# EAGLE schematic scoutfly_nxp (EAGLE 5.06)
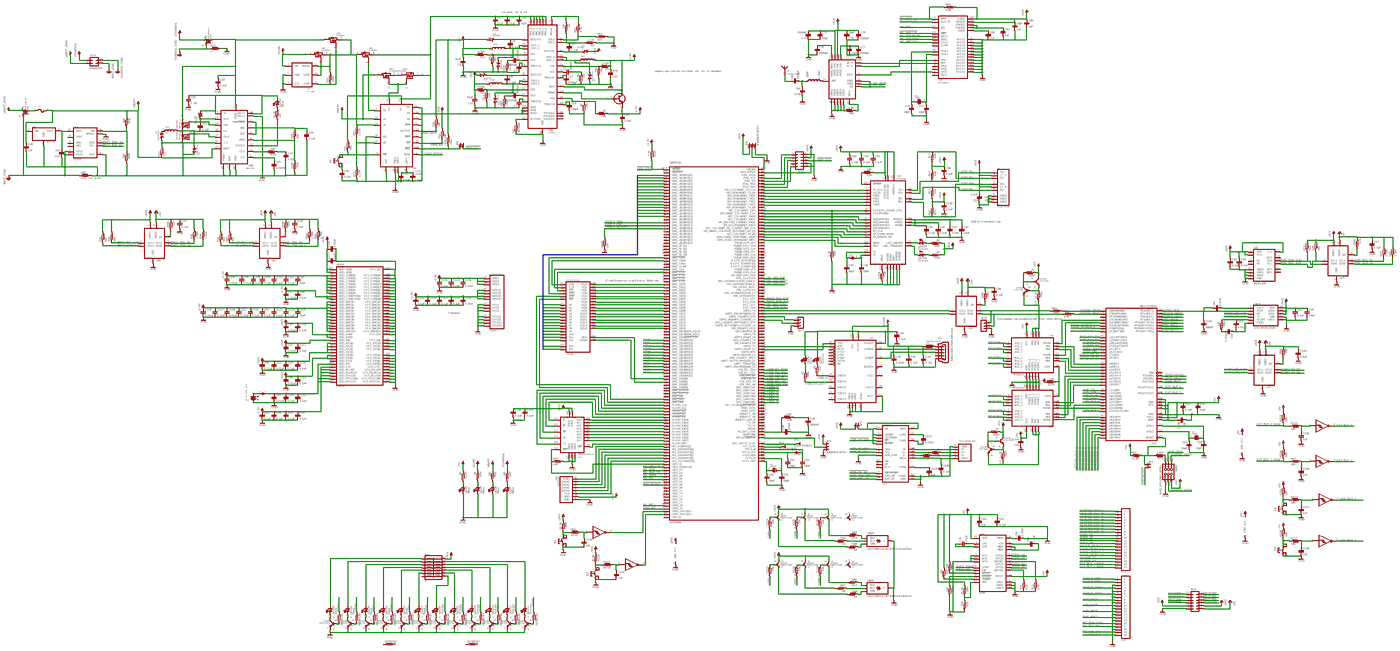
[diagram p0: schematic, sheet 1, overview]
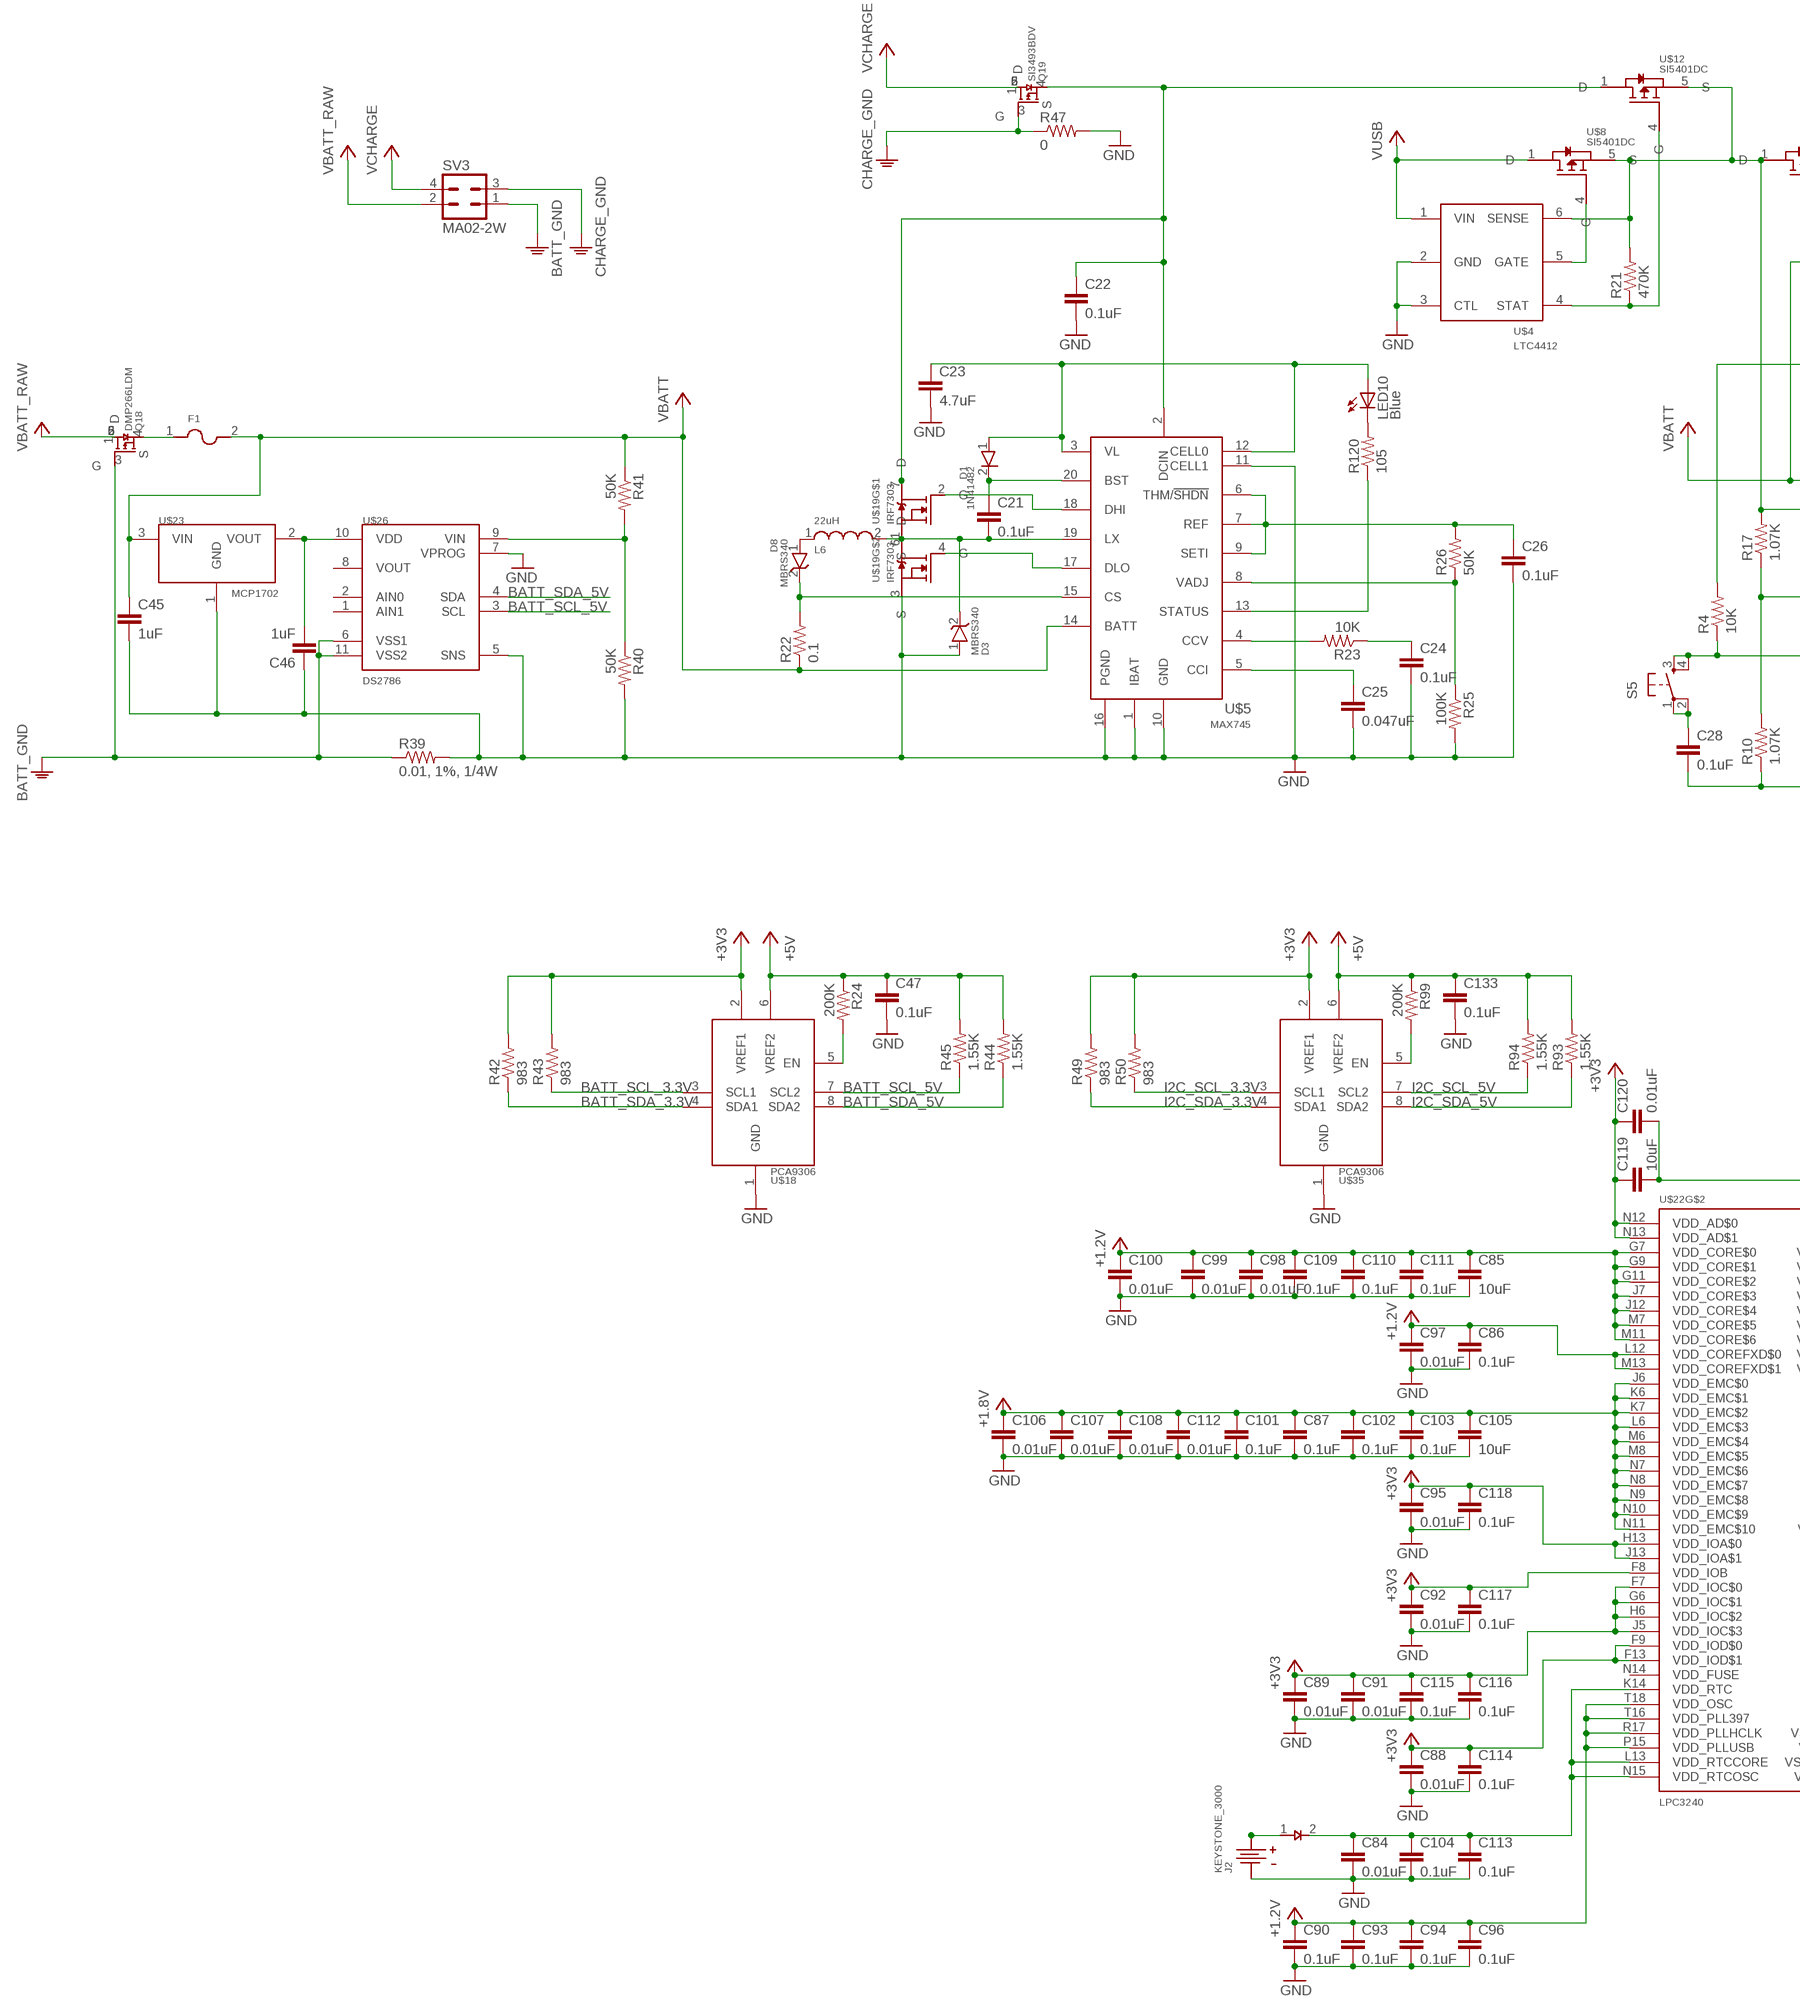
[diagram p1: schematic, sheet 1, part 1 of 7]
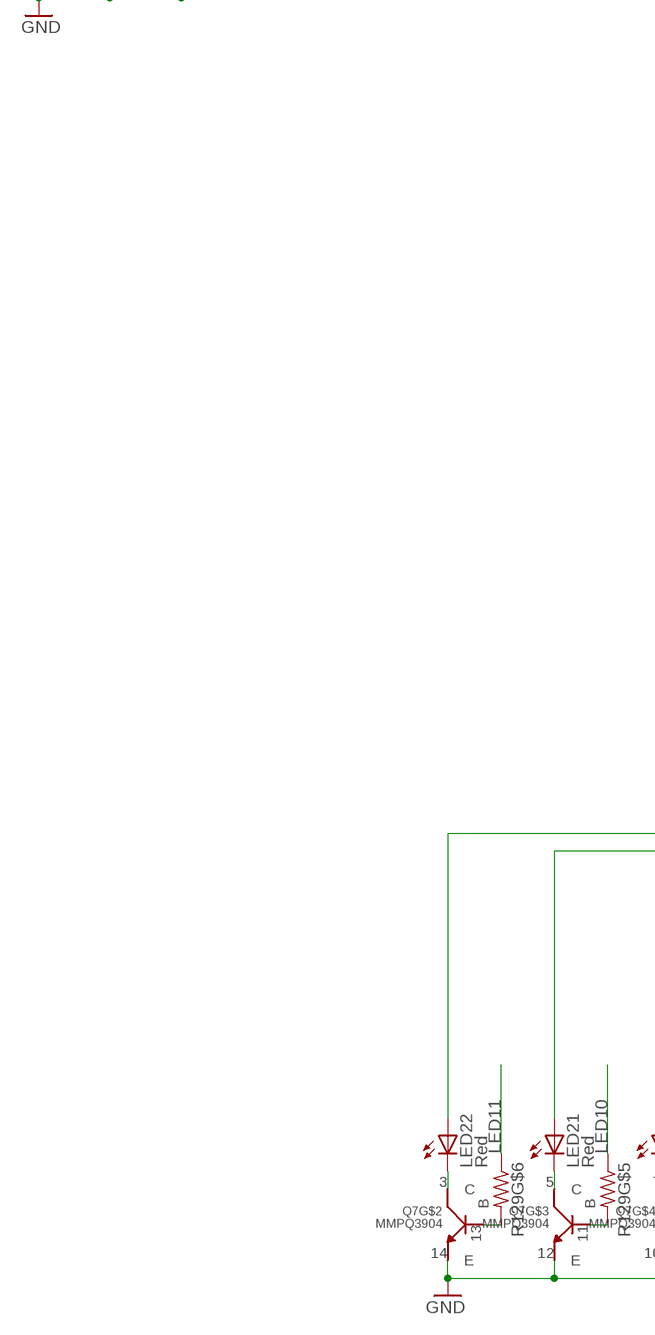
[diagram p2: schematic, sheet 1, part 2 of 7]
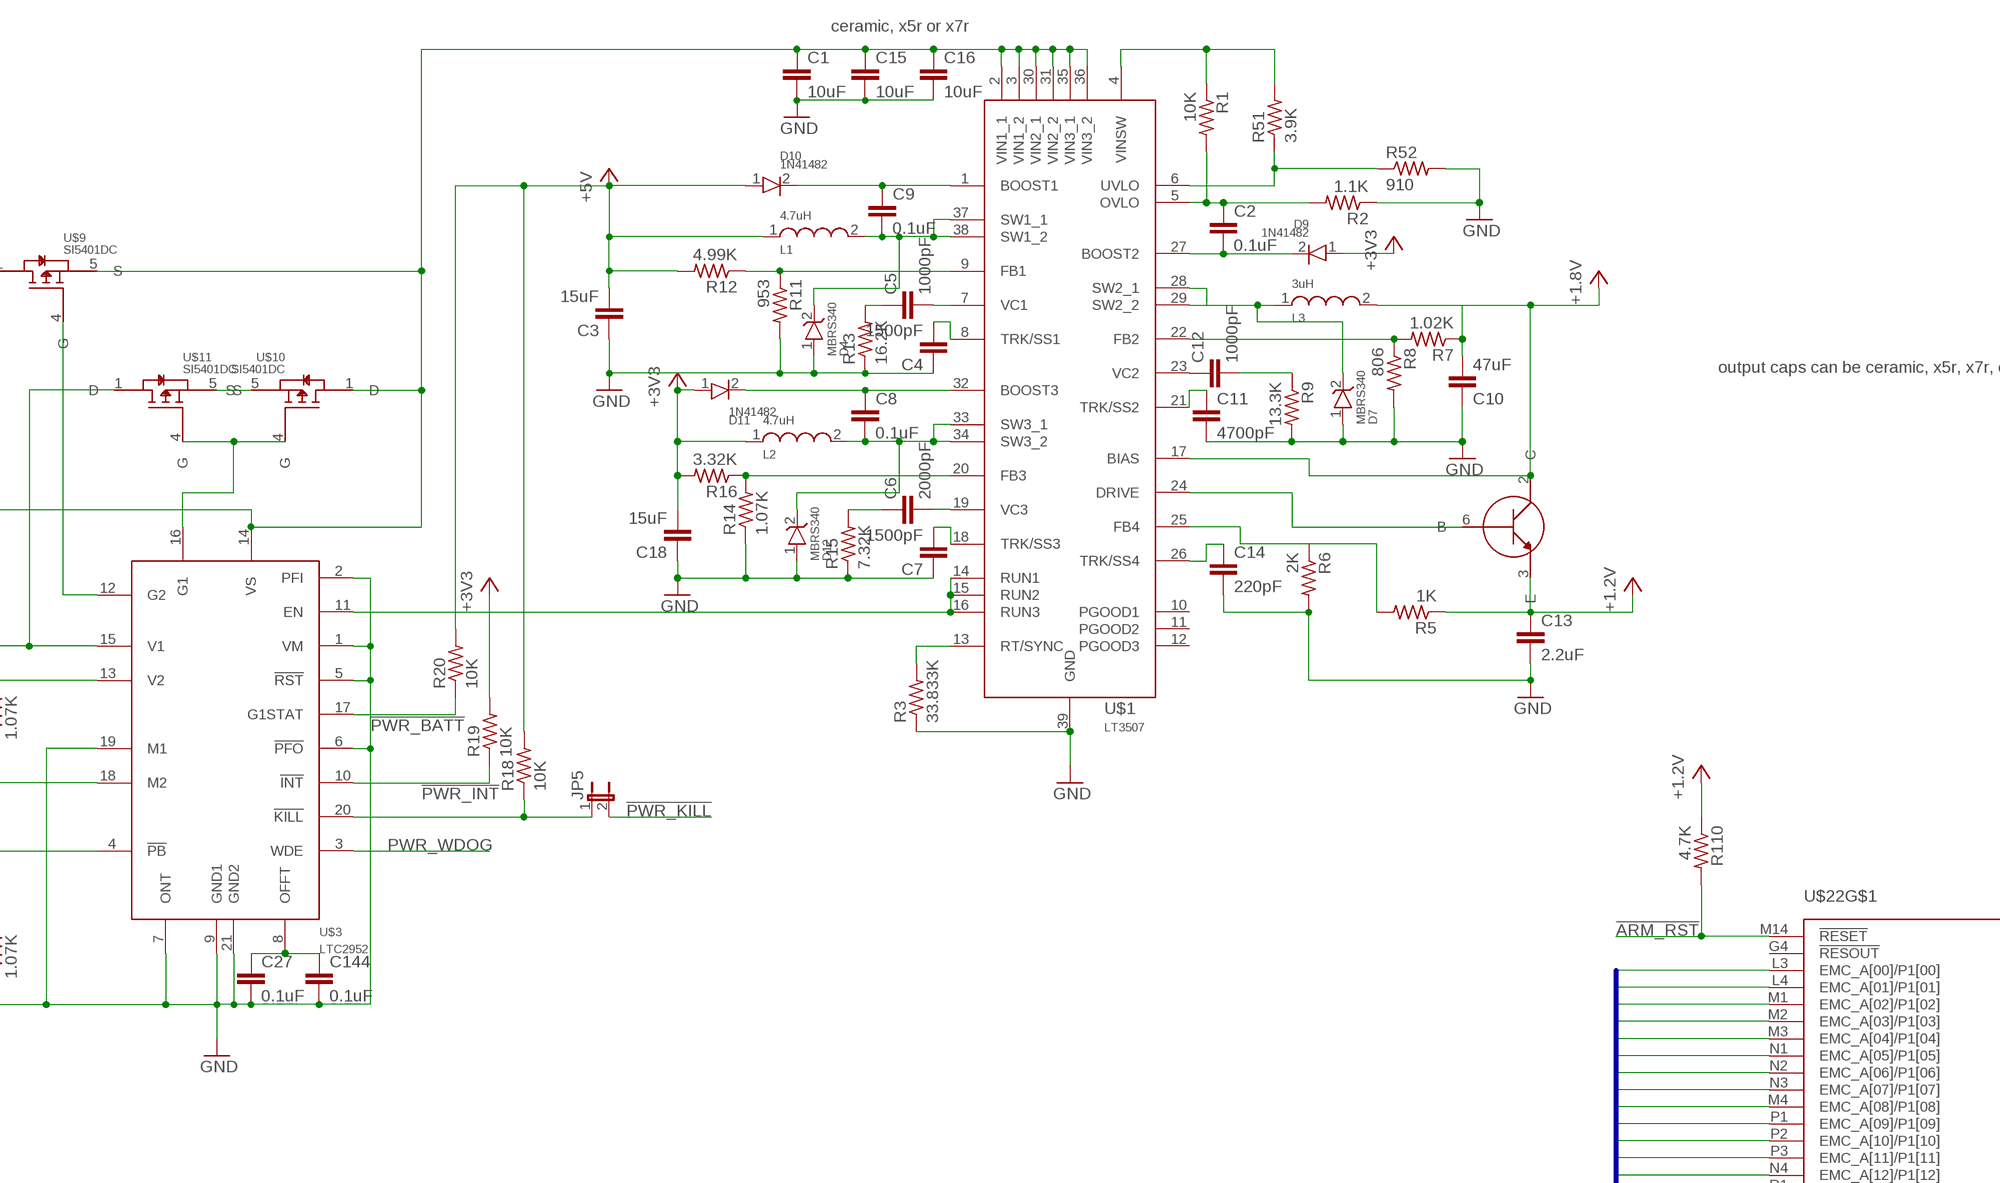
[diagram p3: schematic, sheet 1, part 3 of 7]
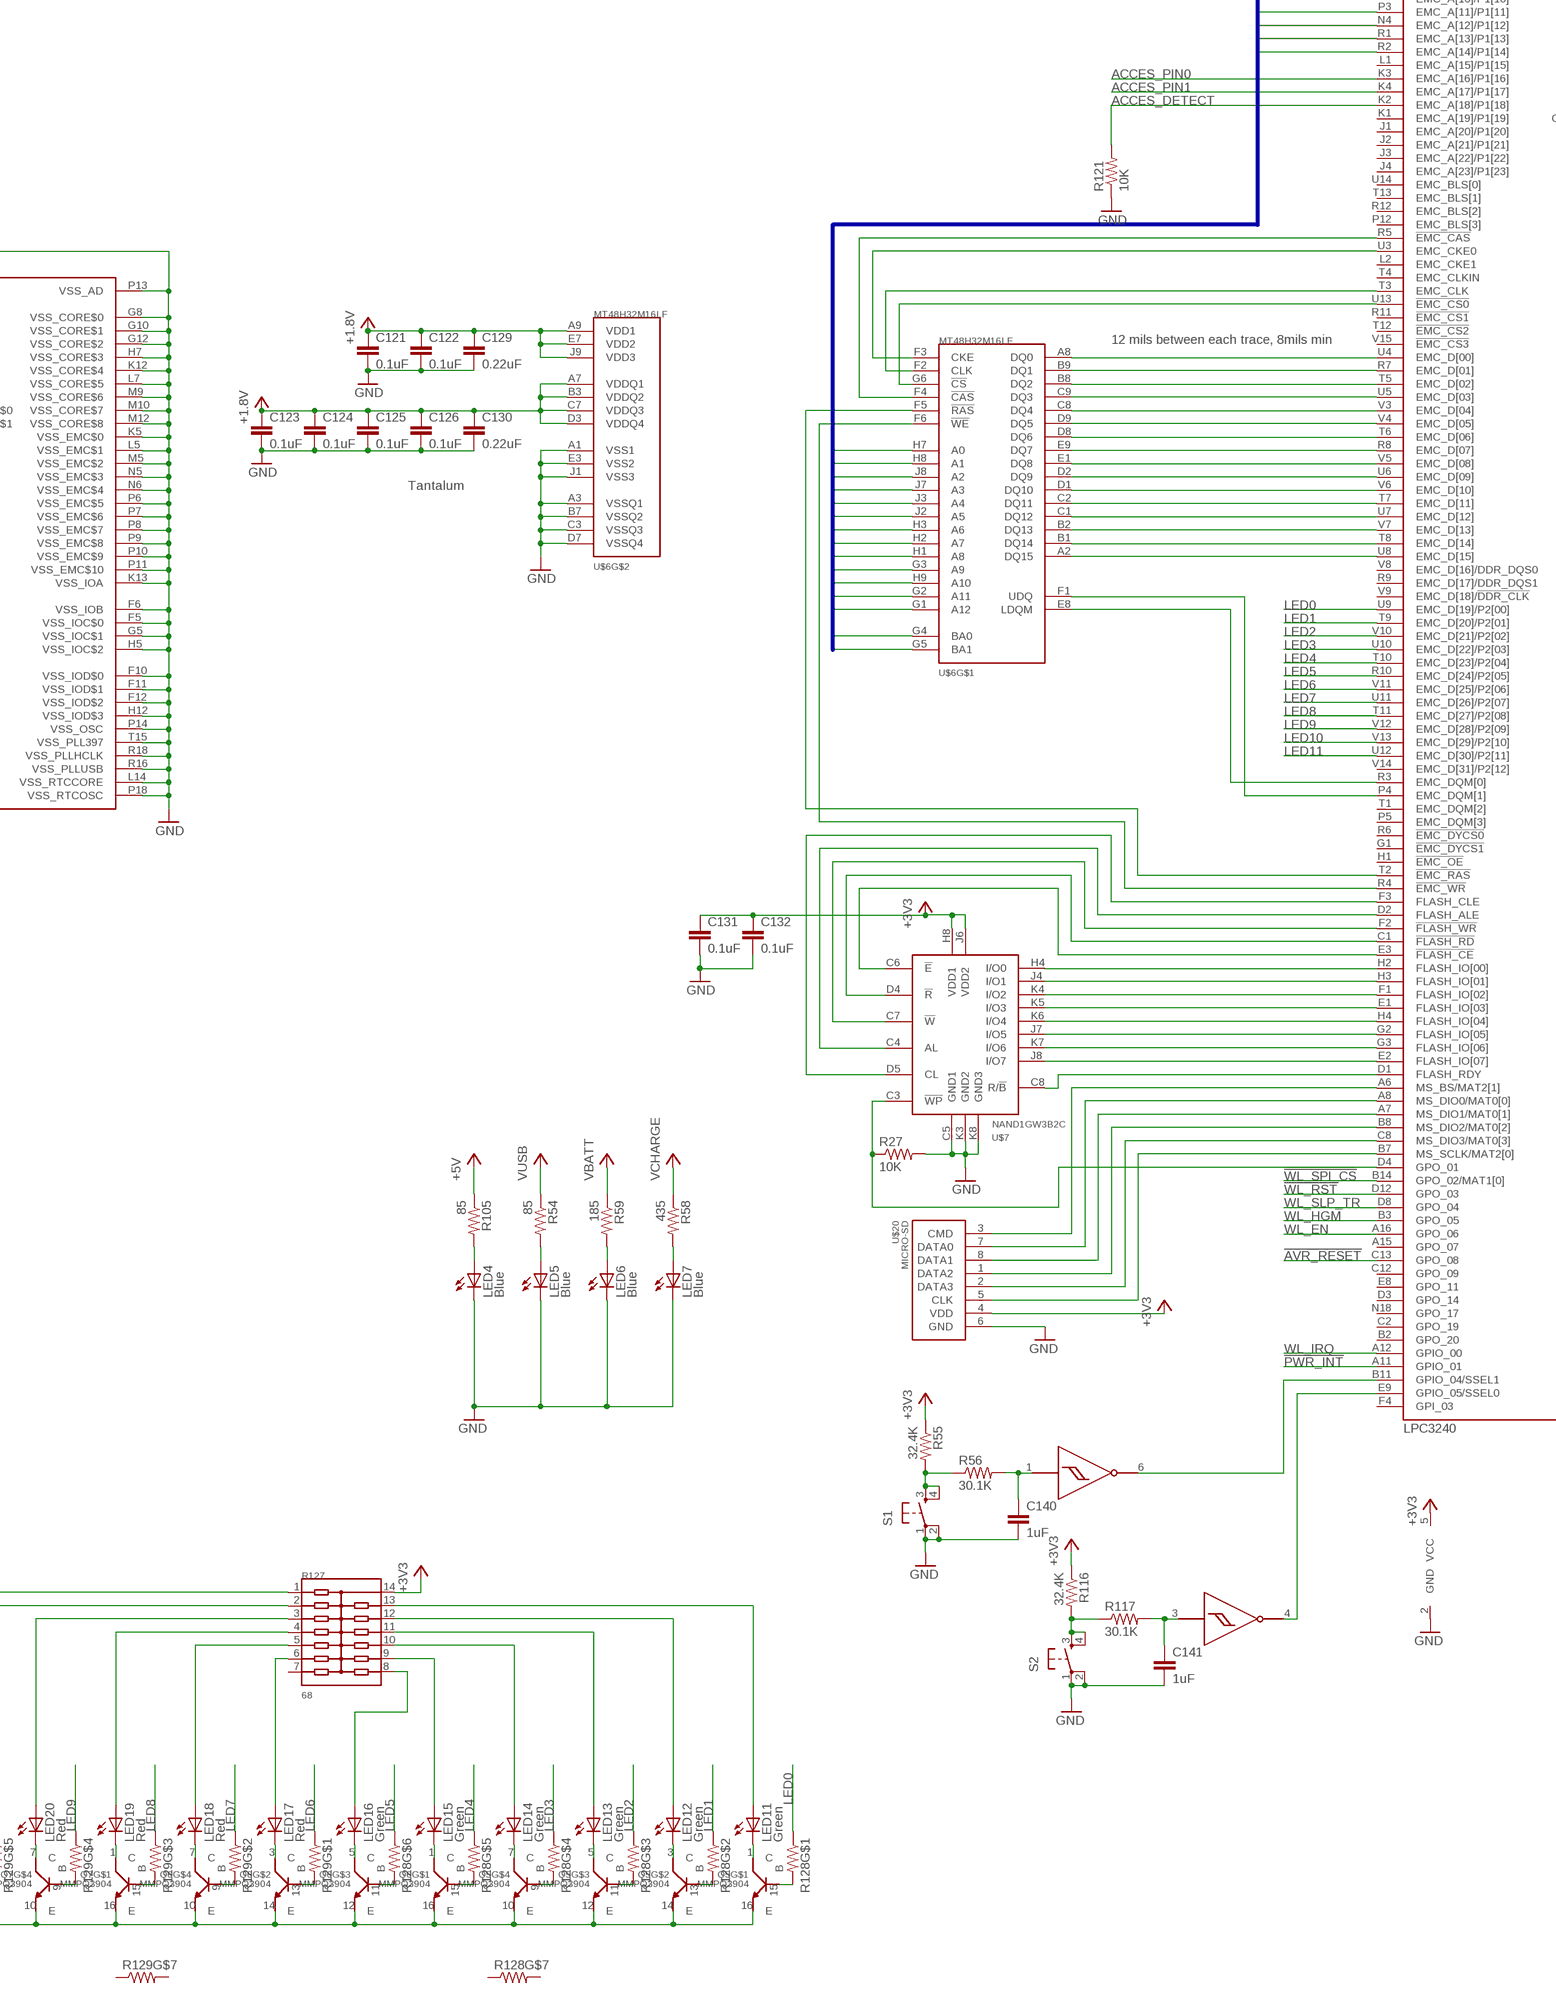
[diagram p4: schematic, sheet 1, part 4 of 7]
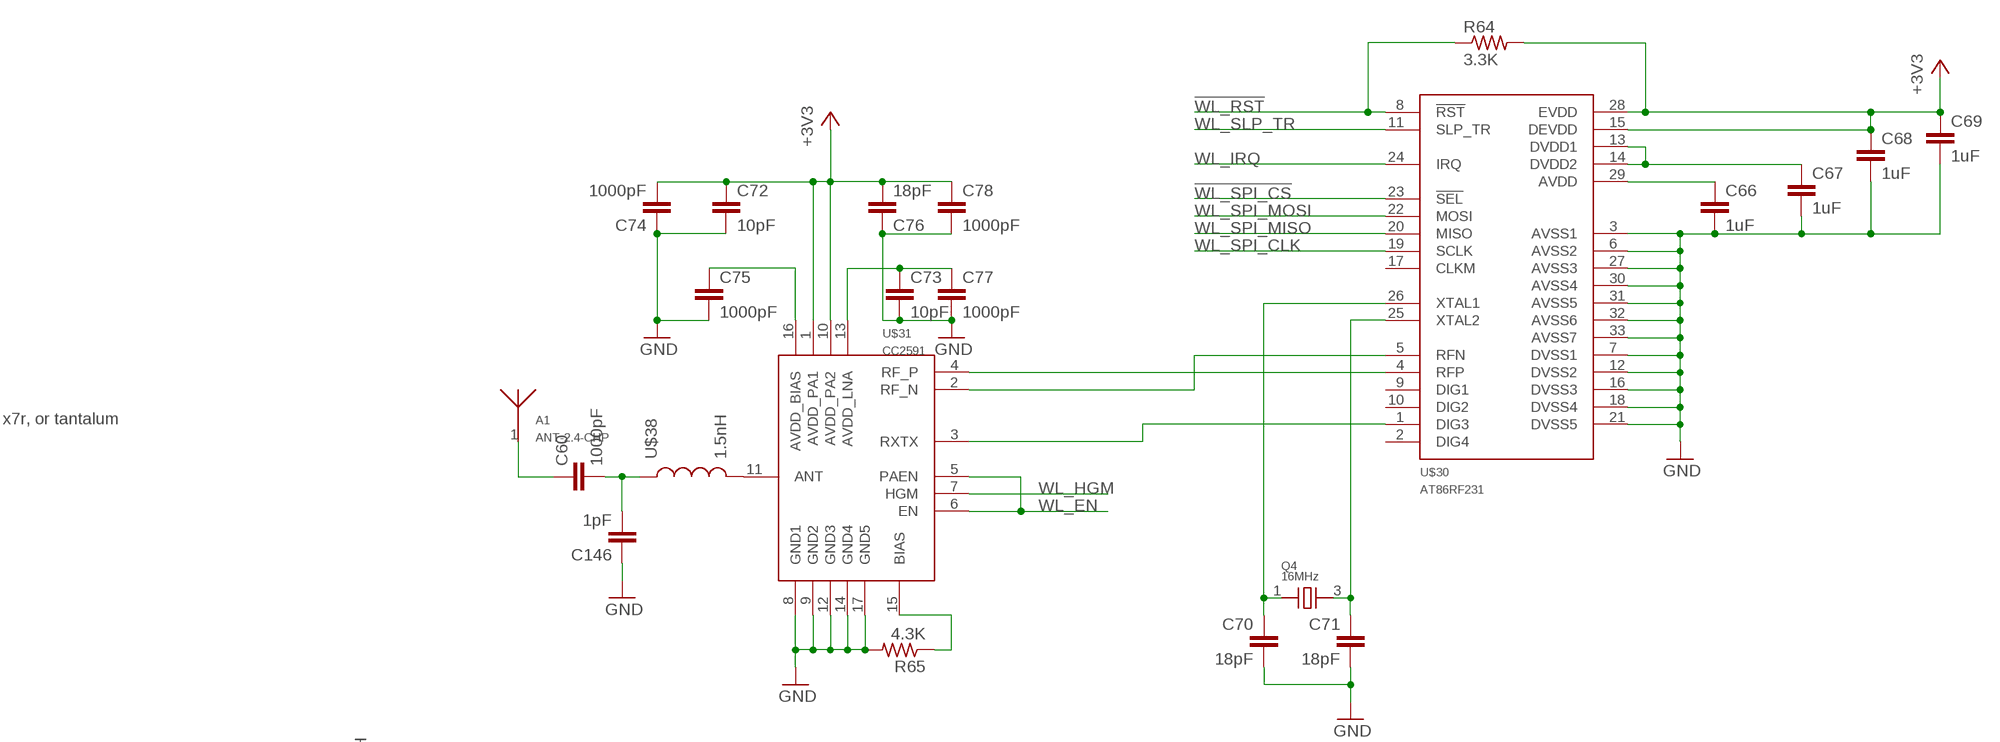
[diagram p5: schematic, sheet 1, part 5 of 7]
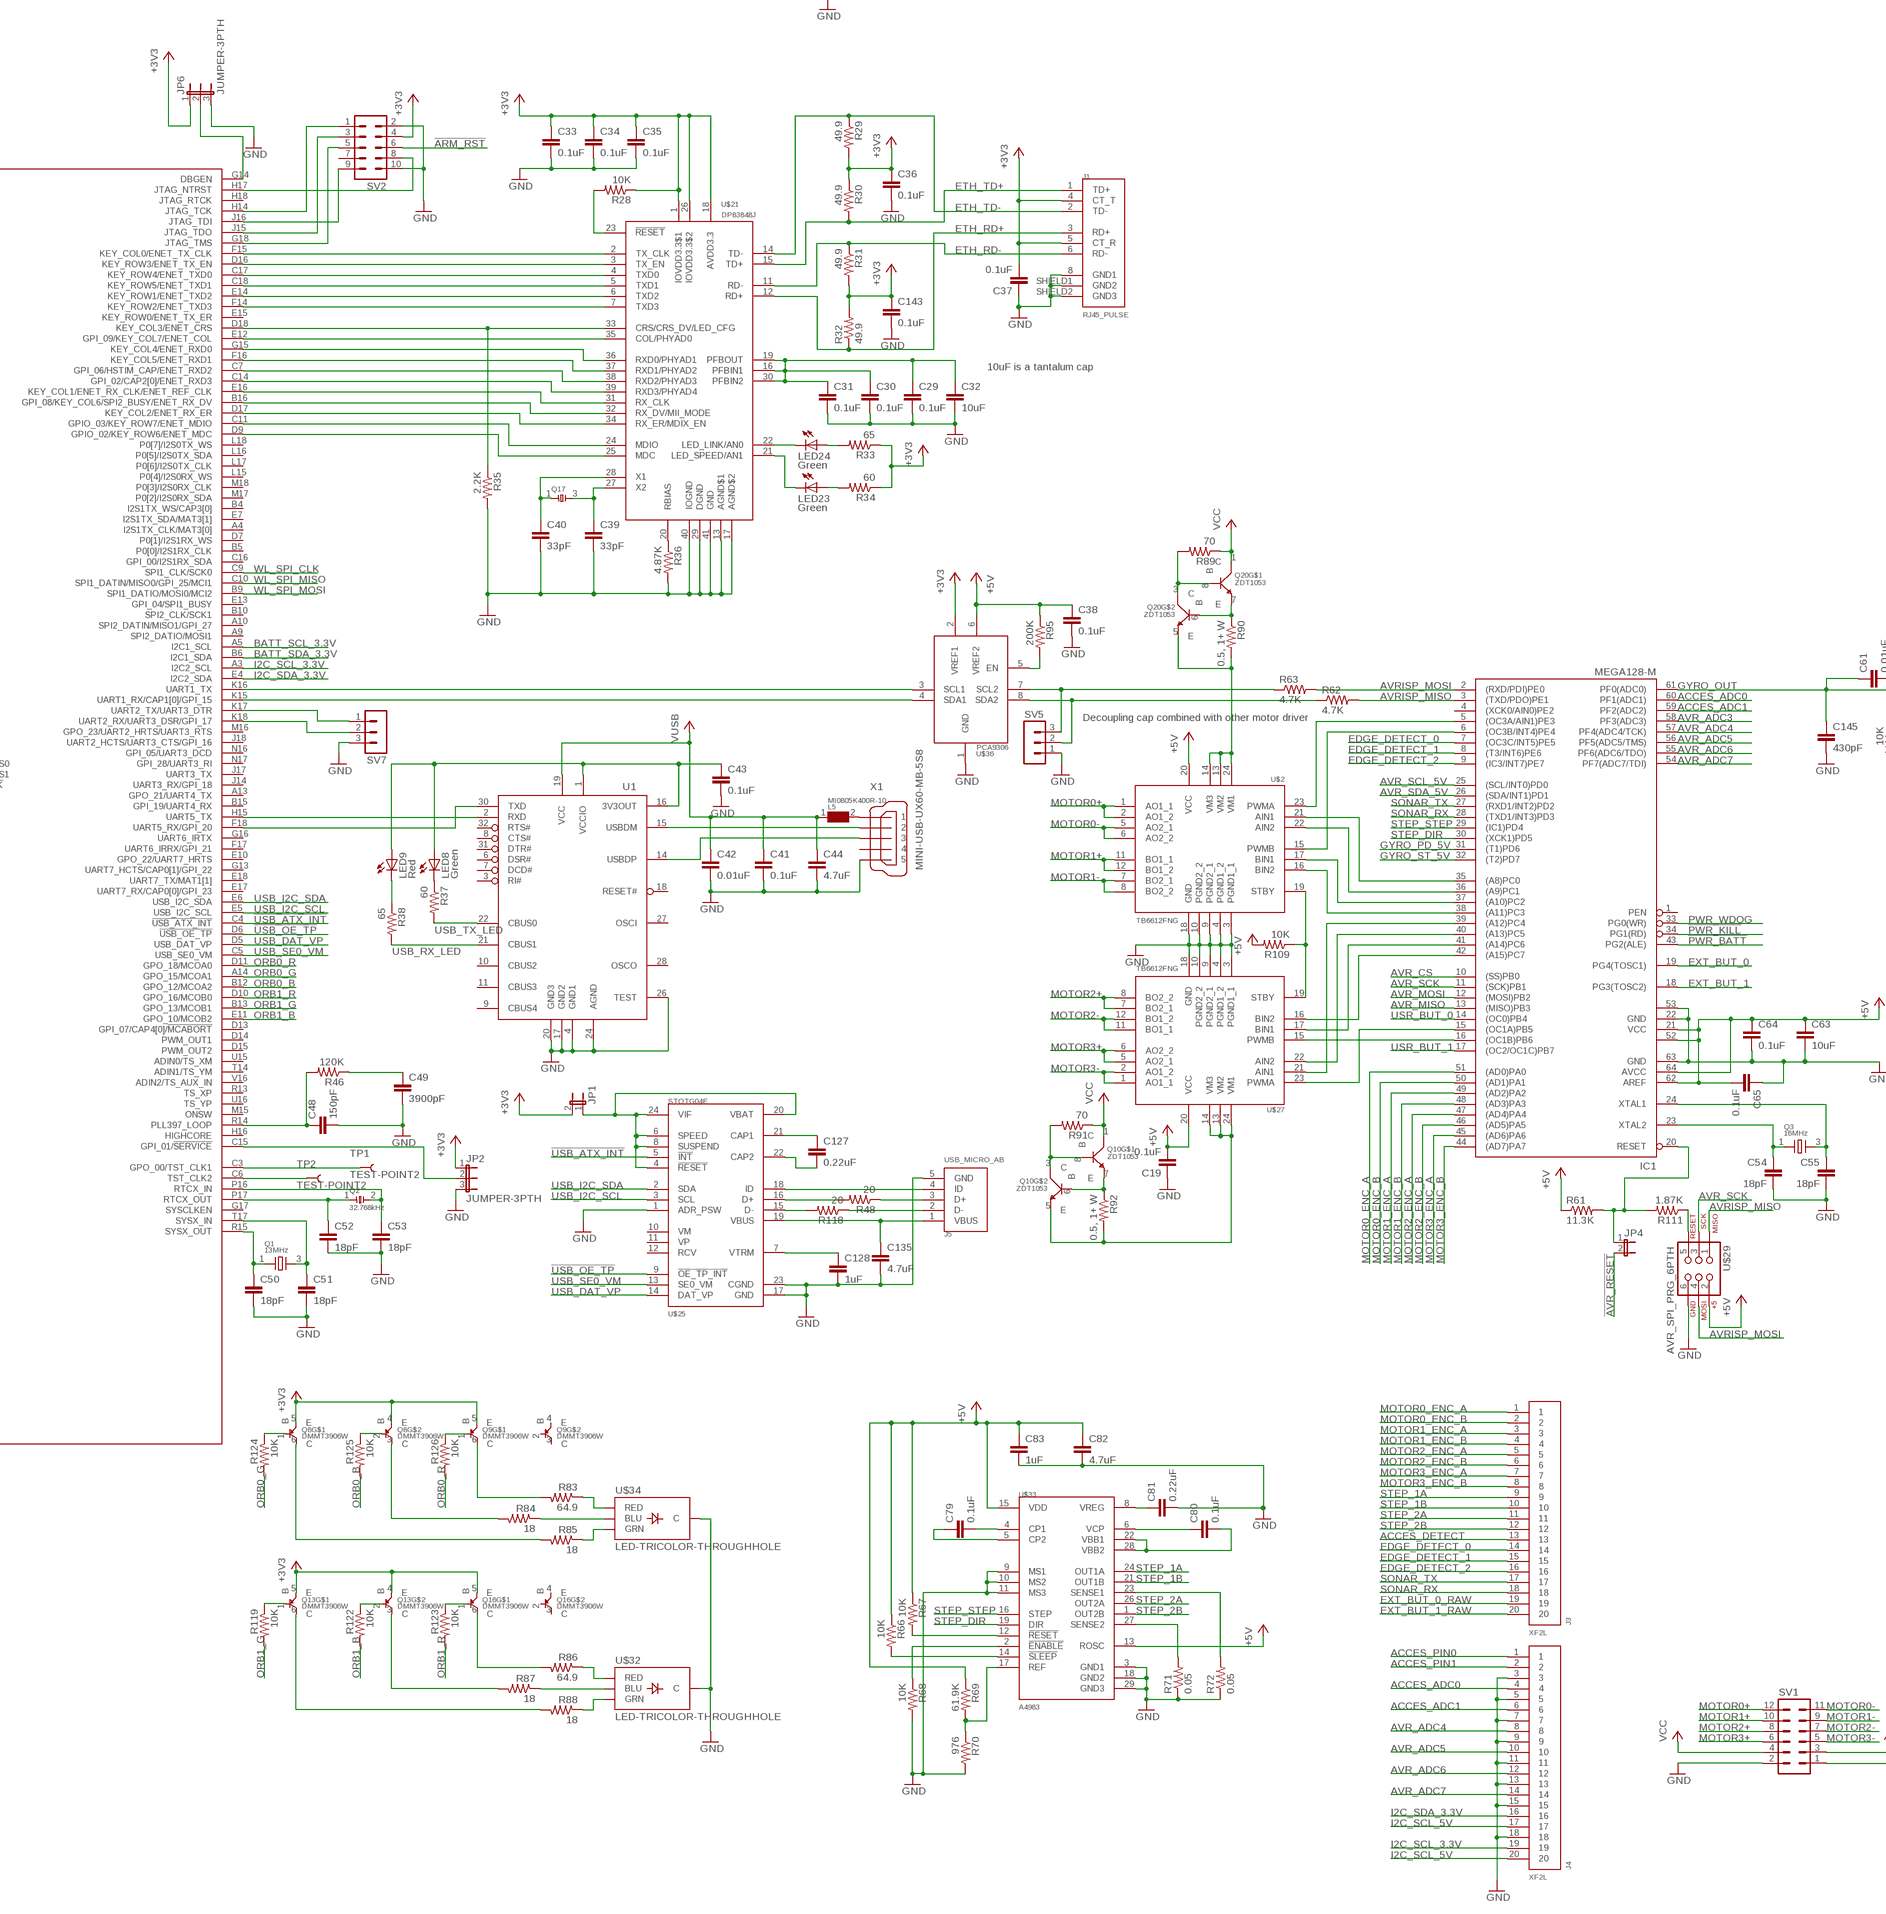
[diagram p6: schematic, sheet 1, part 6 of 7]
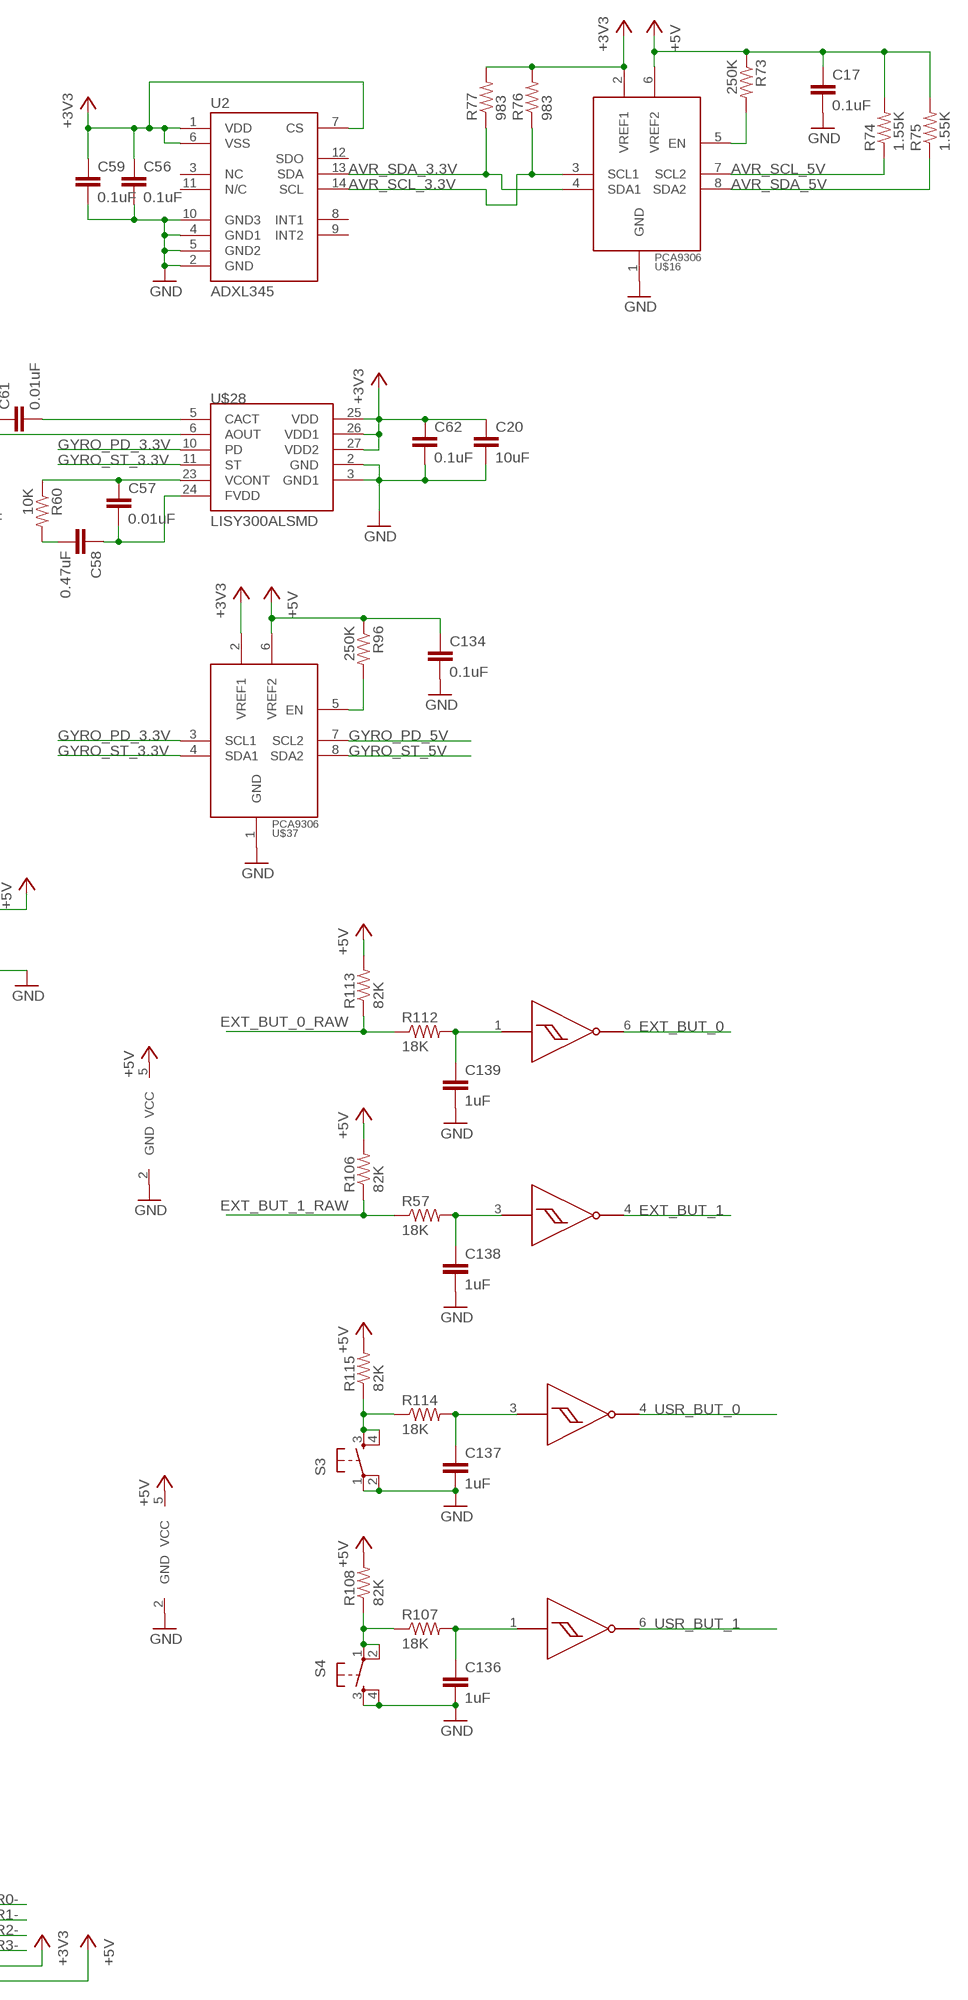
[diagram p7: schematic, sheet 1, part 7 of 7]

## Parts
A1  ANT-2.4-CHP  [CHIP_ANT_2.4GHZ]
C1  10uF  CAP0805  [0805]
C2  0.1uF  CAP0603-CAP  [0603-CAP]
C3  15uF  C-EUC1206  [C1206]
C4  1500pF  CAP0603-CAP  [0603-CAP]
C5  1000pF  CAP0603-CAP  [0603-CAP]
C6  2000pF  CAP0603-CAP  [0603-CAP]
C7  1500pF  CAP0603-CAP  [0603-CAP]
C8  0.1uF  CAP0603-CAP  [0603-CAP]
C9  0.1uF  CAP0603-CAP  [0603-CAP]
C10  47uF  C-EUC1206  [C1206]
C11  4700pF  CAP0603-CAP  [0603-CAP]
C12  1000pF  CAP0603-CAP  [0603-CAP]
C13  2.2uF  CAP0603-CAP  [0603-CAP]
C14  220pF  CAP0603-CAP  [0603-CAP]
C15  10uF  CAP0805  [0805]
C16  10uF  CAP0805  [0805]
C17  0.1uF  CAP0603-CAP  [0603-CAP]
C18  15uF  C-EUC1206  [C1206]
C19  0.1uF  CAP0603-CAP  [0603-CAP]
C20  10uF  CAP0805  [0805]
C21  0.1uF  CAP0603-CAP  [0603-CAP]
C22  0.1uF  CAP0603-CAP  [0603-CAP]
C23  4.7uF  CAP0805  [0805]
C24  0.1uF  CAP0603-CAP  [0603-CAP]
C25  0.047uF  CAP0603-CAP  [0603-CAP]
C26  0.1uF  CAP0603-CAP  [0603-CAP]
C27  0.1uF  CAP0603-CAP  [0603-CAP]
C28  0.1uF  CAP0603-CAP  [0603-CAP]
C29  0.1uF  CAP0603-CAP  [0603-CAP]
C30  0.1uF  CAP0603-CAP  [0603-CAP]
C31  0.1uF  CAP0603-CAP  [0603-CAP]
C32  10uF  C-EUC1206  [C1206]
C33  0.1uF  CAP0603-CAP  [0603-CAP]
C34  0.1uF  CAP0603-CAP  [0603-CAP]
C35  0.1uF  CAP0603-CAP  [0603-CAP]
C36  0.1uF  CAP0603-CAP  [0603-CAP]
C37  0.1uF  CAP0603-CAP  [0603-CAP]
C38  0.1uF  CAP0603-CAP  [0603-CAP]
C39  33pF  CAP0603-CAP  [0603-CAP]
C40  33pF  CAP0603-CAP  [0603-CAP]
C41  0.1uF  CAP0603-CAP  [0603-CAP]
C42  0.01uF  CAP0603-CAP  [0603-CAP]
C43  0.1uF  CAP0603-CAP  [0603-CAP]
C44  4.7uF  CAP0805  [0805]
C45  1uF  CAP0603-CAP  [0603-CAP]
C46  1uF  CAP0603-CAP  [0603-CAP]
C47  0.1uF  CAP0603-CAP  [0603-CAP]
C48  150pF  C-EUC0805  [C0805]
C49  3900pF  C-EUC0805  [C0805]
C50  18pF  CAP0603-CAP  [0603-CAP]
C51  18pF  CAP0603-CAP  [0603-CAP]
C52  18pF  CAP0603-CAP  [0603-CAP]
C53  18pF  CAP0603-CAP  [0603-CAP]
C54  18pF  CAP0603-CAP  [0603-CAP]
C55  18pF  CAP0603-CAP  [0603-CAP]
C56  0.1uF  CAP0603-CAP  [0603-CAP]
C57  0.01uF  CAP0603-CAP  [0603-CAP]
C58  0.47uF  CAP0603-CAP  [0603-CAP]
C59  0.1uF  CAP0603-CAP  [0603-CAP]
C60  1000pF  CAP0603-CAP  [0603-CAP]
C61  0.01uF  CAP0603-CAP  [0603-CAP]
C62  0.1uF  CAP0603-CAP  [0603-CAP]
C63  10uF  CAP0805  [0805]
C64  0.1uF  CAP0603-CAP  [0603-CAP]
C65  0.1uF  CAP0603-CAP  [0603-CAP]
C66  1uF  CAP0603-CAP  [0603-CAP]
C67  1uF  CAP0603-CAP  [0603-CAP]
C68  1uF  CAP0603-CAP  [0603-CAP]
C69  1uF  CAP0603-CAP  [0603-CAP]
C70  18pF  CAP0603-CAP  [0603-CAP]
C71  18pF  CAP0603-CAP  [0603-CAP]
C72  10pF  CAP0603-CAP  [0603-CAP]
C73  10pF  CAP0603-CAP  [0603-CAP]
C74  1000pF  CAP0603-CAP  [0603-CAP]
C75  1000pF  CAP0603-CAP  [0603-CAP]
C76  18pF  CAP0603-CAP  [0603-CAP]
C77  1000pF  CAP0603-CAP  [0603-CAP]
C78  1000pF  CAP0603-CAP  [0603-CAP]
C79  0.1uF  CAP0603-CAP  [0603-CAP]
C80  0.1uF  CAP0603-CAP  [0603-CAP]
C81  0.22uF  CAP0603-CAP  [0603-CAP]
C82  4.7uF  C-EUC0805  [C0805]
C83  1uF  CAP0603-CAP  [0603-CAP]
C84  0.01uF  CAP0603-CAP  [0603-CAP]
C85  10uF  CAP0805  [0805]
C86  0.1uF  CAP0603-CAP  [0603-CAP]
C87  0.1uF  CAP0603-CAP  [0603-CAP]
C88  0.01uF  CAP0603-CAP  [0603-CAP]
C89  0.01uF  CAP0603-CAP  [0603-CAP]
C90  0.1uF  CAP0603-CAP  [0603-CAP]
C91  0.01uF  CAP0603-CAP  [0603-CAP]
C92  0.01uF  CAP0603-CAP  [0603-CAP]
C93  0.1uF  CAP0603-CAP  [0603-CAP]
C94  0.1uF  CAP0603-CAP  [0603-CAP]
C95  0.01uF  CAP0603-CAP  [0603-CAP]
C96  0.1uF  CAP0603-CAP  [0603-CAP]
C97  0.01uF  CAP0603-CAP  [0603-CAP]
C98  0.01uF  CAP0603-CAP  [0603-CAP]
C99  0.01uF  CAP0603-CAP  [0603-CAP]
C100  0.01uF  CAP0603-CAP  [0603-CAP]
C101  0.1uF  CAP0603-CAP  [0603-CAP]
C102  0.1uF  CAP0603-CAP  [0603-CAP]
C103  0.1uF  CAP0603-CAP  [0603-CAP]
C104  0.1uF  CAP0603-CAP  [0603-CAP]
C105  10uF  CAP0805  [0805]
C106  0.01uF  CAP0603-CAP  [0603-CAP]
C107  0.01uF  CAP0603-CAP  [0603-CAP]
C108  0.01uF  CAP0603-CAP  [0603-CAP]
C109  0.1uF  CAP0603-CAP  [0603-CAP]
C110  0.1uF  CAP0603-CAP  [0603-CAP]
C111  0.1uF  CAP0603-CAP  [0603-CAP]
C112  0.01uF  CAP0603-CAP  [0603-CAP]
C113  0.1uF  CAP0603-CAP  [0603-CAP]
C114  0.1uF  CAP0603-CAP  [0603-CAP]
C115  0.1uF  CAP0603-CAP  [0603-CAP]
C116  0.1uF  CAP0603-CAP  [0603-CAP]
C117  0.1uF  CAP0603-CAP  [0603-CAP]
C118  0.1uF  CAP0603-CAP  [0603-CAP]
C119  10uF  CAP0805  [0805]
C120  0.01uF  CAP0603-CAP  [0603-CAP]
C121  0.1uF  C-EUC1206  [C1206]
C122  0.1uF  C-EUC1206  [C1206]
C123  0.1uF  C-EUC1206  [C1206]
C124  0.1uF  C-EUC1206  [C1206]
C125  0.1uF  C-EUC1206  [C1206]
C126  0.1uF  C-EUC1206  [C1206]
C127  0.22uF  CAP0603-CAP  [0603-CAP]
C128  1uF  CAP0603-CAP  [0603-CAP]
C129  0.22uF  C-EUC1206  [C1206]
C130  0.22uF  C-EUC1206  [C1206]
C131  0.1uF  CAP0603-CAP  [0603-CAP]
C132  0.1uF  CAP0603-CAP  [0603-CAP]
C133  0.1uF  CAP0603-CAP  [0603-CAP]
C134  0.1uF  CAP0603-CAP  [0603-CAP]
C135  4.7uF  CAP0805  [0805]
C136  1uF  CAP0603-CAP  [0603-CAP]
C137  1uF  CAP0603-CAP  [0603-CAP]
C138  1uF  CAP0603-CAP  [0603-CAP]
C139  1uF  CAP0603-CAP  [0603-CAP]
C140  1uF  CAP0603-CAP  [0603-CAP]
C141  1uF  CAP0603-CAP  [0603-CAP]
C143  0.1uF  CAP0603-CAP  [0603-CAP]
C144  0.1uF  CAP0603-CAP  [0603-CAP]
C145  430pF  CAP0603-CAP  [0603-CAP]
C146  1pF  CAP0603-CAP  [0603-CAP]
D1  1N41482  [SOD-123]
D3  MBRS340  [SMC/DO-214AB]
D4  MBRS340  [SMC/DO-214AB]
D6  BAS69KFILM  [SOD523]
D7  MBRS340  [SMC/DO-214AB]
D8  MBRS340  [SMC/DO-214AB]
D9  1N41482  [SOD-123]
D10  1N41482  [SOD-123]
D11  1N41482  [SOD-123]
D12  MBRS340  [SMC/DO-214AB]
F1  MF-SM200  [SM200]
IC1  MEGA128-M  [MLF64]
J1  RJ45_PULSE  [RJ45-PULSE]
J2  KEYSTONE_3000  [COIN_CELL]
J3  XF2L  [OMRON_XF]
J4  XF2L  [OMRON_XF]
J5  USB_MICRO_AB  [MICRO_USB_AB_TYCO]
JP1  JUMPER-2PTH  [1X02]
JP2  JUMPER-3PTH  [1X03]
JP4  JUMPER-2PTH  [1X02]
JP5  JUMPER-2PTH  [1X02]
JP6  JUMPER-3PTH  [1X03]
L1  4.7uH  DR74-XXX-R  [DR74]
L2  4.7uH  DR74-XXX-R  [DR74]
L3  3uH  NR6045TXXX  [NR6045]
L5  MI0805K400R-10  [0805]
L6  22uH  DR125-XXX-R  [DR125]
LED4  Blue  LED0603  [LED-0603]
LED5  Blue  LED0603  [LED-0603]
LED6  Blue  LED0603  [LED-0603]
LED7  Blue  LED0603  [LED-0603]
LED8  Green  LED0603  [LED-0603]
LED9  Red  LED0603  [LED-0603]
LED10  Blue  LED0603  [LED-0603]
LED11  Green  LED0603  [LED-0603]
LED12  Green  LED0603  [LED-0603]
LED13  Green  LED0603  [LED-0603]
LED14  Green  LED0603  [LED-0603]
LED15  Green  LED0603  [LED-0603]
LED16  Green  LED0603  [LED-0603]
LED17  Red  LED0603  [LED-0603]
LED18  Red  LED0603  [LED-0603]
LED19  Red  LED0603  [LED-0603]
LED20  Red  LED0603  [LED-0603]
LED21  Red  LED0603  [LED-0603]
LED22  Red  LED0603  [LED-0603]
LED23  Green  LED0603  [LED-0603]
LED24  Green  LED0603  [LED-0603]
Q1  13MHz  NX5032SA  [NX5032SA]
Q2  32.768kHz  ECX-31B  [ECX-31B]
Q3  16MHz  NX3225SA  [NX3225SA]
Q4  16MHz  NX3225SA  [NX3225SA]
Q5  MMPQ3904  [16-SOIC]
Q6  MMPQ3904  [16-SOIC]
Q7  MMPQ3904  [16-SOIC]
Q8  DMMT3906W  [SOT363]
Q9  DMMT3906W  [SOT363]
Q10  ZDT1053  [SOT223-8]
Q13  DMMT3906W  [SOT363]
Q16  DMMT3906W  [SOT363]
Q17  ECX-53B  [ECX-53B]
Q18  DMP266LDM  [SOT26]
Q19  SI3493BDV  [6-TSOP]
Q20  ZDT1053  [SOT223-8]
R1  10K  R-US_R0603  [R0603]
R2  1.1K  R-US_R0603  [R0603]
R3  33.833K  R-US_R0603  [R0603]
R4  10K  R-US_R0603  [R0603]
R5  1K  R-US_R0603  [R0603]
R6  2K  R-US_R0603  [R0603]
R7  1.02K  R-US_R0603  [R0603]
R8  806  R-US_R0603  [R0603]
R9  13.3K  R-US_R0603  [R0603]
R10  1.07K  R-US_R0603  [R0603]
R11  953  R-US_R0603  [R0603]
R12  4.99K  R-US_R0603  [R0603]
R13  16.2K  R-US_R0603  [R0603]
R14  1.07K  R-US_R0603  [R0603]
R15  7.32K  R-US_R0603  [R0603]
R16  3.32K  R-US_R0603  [R0603]
R17  1.07K  R-US_R0603  [R0603]
R18  10K  R-US_R0603  [R0603]
R19  10K  R-US_R0603  [R0603]
R20  10K  R-US_R0603  [R0603]
R21  470K  R-US_R0603  [R0603]
R22  0.1  R-US_R0603  [R0603]
R23  10K  R-US_R0603  [R0603]
R24  200K  R-US_R0603  [R0603]
R25  100K  R-US_R0603  [R0603]
R26  50K  R-US_R0603  [R0603]
R27  10K  R-US_R0603  [R0603]
R28  10K  R-US_R0603  [R0603]
R29  49.9  R-US_R0603  [R0603]
R30  49.9  R-US_R0603  [R0603]
R31  49.9  R-US_R0603  [R0603]
R32  49.9  R-US_R0603  [R0603]
R33  65  R-US_R0603  [R0603]
R34  60  R-US_R0603  [R0603]
R35  2.2K  R-US_R0603  [R0603]
R36  4.87K  R-US_R0603  [R0603]
R37  60  R-US_R0603  [R0603]
R38  65  R-US_R0603  [R0603]
R39  0.01, 1%, 1/4W  RESISTOR  [0805]
R40  50K  R-US_R0603  [R0603]
R41  50K  R-US_R0603  [R0603]
R42  983  R-US_R0603  [R0603]
R43  983  R-US_R0603  [R0603]
R44  1.55K  R-US_R0603  [R0603]
R45  1.55K  R-US_R0603  [R0603]
R46  120K  R-US_R0603  [R0603]
R47  0  R-US_R0603  [R0603]
R48  20  R-US_R0603  [R0603]
R49  983  R-US_R0603  [R0603]
R50  983  R-US_R0603  [R0603]
R51  3.9K  R-US_R0603  [R0603]
R52  910  R-US_R0603  [R0603]
R54  85  R-US_R0603  [R0603]
R55  32.4K  R-US_R0603  [R0603]
R56  30.1K  R-US_R0603  [R0603]
R57  18K  R-US_R0603  [R0603]
R58  435  R-US_R0603  [R0603]
R59  185  R-US_R0603  [R0603]
R60  10K  R-US_R0603  [R0603]
R61  11.3K  R-US_R0603  [R0603]
R62  4.7K  R-US_R0603  [R0603]
R63  4.7K  R-US_R0603  [R0603]
R64  3.3K  R-US_R0603  [R0603]
R65  4.3K  R-US_R0603  [R0603]
R66  10K  R-US_R0603  [R0603]
R67  10K  R-US_R0603  [R0603]
R68  10K  R-US_R0603  [R0603]
R69  61.9K  R-US_R0603  [R0603]
R70  976  R-US_R0603  [R0603]
R71  0.05  R-US_R0603  [R0603]
R72  0.05  R-US_R0603  [R0603]
R73  250K  R-US_R0603  [R0603]
R74  1.55K  R-US_R0603  [R0603]
R75  1.55K  R-US_R0603  [R0603]
R76  983  R-US_R0603  [R0603]
R77  983  R-US_R0603  [R0603]
R83  64.9  R-US_R0603  [R0603]
R84  18  R-US_R0603  [R0603]
R85  18  R-US_R0603  [R0603]
R86  64.9  R-US_R0603  [R0603]
R87  18  R-US_R0603  [R0603]
R88  18  R-US_R0603  [R0603]
R89  70  R-US_R0603  [R0603]
R90  0.5, 1+ W  R-US_R0603  [R0603]
R91  70  R-US_R0603  [R0603]
R92  0.5, 1+ W  R-US_R0603  [R0603]
R93  1.55K  R-US_R0603  [R0603]
R94  1.55K  R-US_R0603  [R0603]
R95  200K  R-US_R0603  [R0603]
R96  250K  R-US_R0603  [R0603]
R99  200K  R-US_R0603  [R0603]
R105  85  R-US_R0603  [R0603]
R106  82K  R-US_R0603  [R0603]
R107  18K  R-US_R0603  [R0603]
R108  82K  R-US_R0603  [R0603]
R109  10K  R-US_R0603  [R0603]
R110  4.7K  R-US_R0603  [R0603]
R111  1.87K  R-US_R0603  [R0603]
R112  18K  R-US_R0603  [R0603]
R113  82K  R-US_R0603  [R0603]
R114  18K  R-US_R0603  [R0603]
R115  82K  R-US_R0603  [R0603]
R116  32.4K  R-US_R0603  [R0603]
R117  30.1K  R-US_R0603  [R0603]
R118  20  R-US_R0603  [R0603]
R119  10K  R-US_R0603  [R0603]
R120  105  R-US_R0603  [R0603]
R121  10K  R-US_R0603  [R0603]
R122  10K  R-US_R0603  [R0603]
R123  10K  R-US_R0603  [R0603]
R124  10K  R-US_R0603  [R0603]
R125  10K  R-US_R0603  [R0603]
R126  10K  R-US_R0603  [R0603]
R127  68  RESNET_BUS_13  [14-SOIC_CTS]
R128  RESNET_ISO_7  [14-SOIC_CTS]
R129  RESNET_ISO_7  [14-SOIC_CTS]
S1  TAC_SWITCHSMD  [TACTILE_SWITCH_SMD]
S2  TAC_SWITCHSMD  [TACTILE_SWITCH_SMD]
S3  TAC_SWITCHSMD  [TACTILE_SWITCH_SMD]
S4  TAC_SWITCHSMD  [TACTILE_SWITCH_SMD]
S5  TAC_SWITCHSMD  [TACTILE_SWITCH_SMD]
SV1  MA06-2W  [MA06-2W]
SV2  MA05-2  [MA05-2]
SV3  MA02-2W  [MA02-2W]
SV5  MA03-1  [MA03-1]
SV7  MA03-1  [MA03-1]
TP1  TEST-POINT2  [PAD.02X.02]
TP2  TEST-POINT2  [PAD.02X.02]
U1  FT232RQ  [LQFP32]
U2  ADXL345  [LGA14]
U3  NL27WZ14  [SOT363]
U4  NL27WZ14  [SOT363]
U5  NL27WZ14  [SOT363]
U$1  LT3507  [38-QFN]
U$2  TB6612FNG  [24-SSOP]
U$3  LTC2952  [20-QFN]
U$4  LTC4412  [6-TSOT23]
U$5  MAX745  [20-SSOP]
U$6  MT48H32M16LF  [54-VFBGA]
U$7  NAND1GW3B2C  [63-VFBGA]
U$8  SI5401DC  [1206-8_CHIPFET]
U$9  SI5401DC  [1206-8_CHIPFET]
U$10  SI5401DC  [1206-8_CHIPFET]
U$11  SI5401DC  [1206-8_CHIPFET]
U$12  SI5401DC  [1206-8_CHIPFET]
U$16  PCA9306  [TSSOP8]
U$17  NSS30071MR6T1G  [6-SC74]
U$18  PCA9306  [TSSOP8]
U$19  IRF7303  [8-SOIC]
U$20  MICRO-SD  [MICRO_SD]
U$21  DP83848J  [40-LLP]
U$22  LPC3240  [SOT1048-1]
U$23  MCP1702  [SOT23]
U$25  STOTG04E  [QFN-24]
U$26  DS2786  [10-TDFN]
U$27  TB6612FNG  [24-SSOP]
U$28  LISY300ALSMD  [LGA28]
U$29  AVR_SPI_PRG_6PTH  [2X3]
U$30  AT86RF231  [32-QFN]
U$31  CC2591  [16-QFN]
U$32  LED-TRICOLOR-THROUGHHOLE  [LED-TRICOLOR-THROUGHHOLE]
U$33  A4983  [28-QFN]
U$34  LED-TRICOLOR-THROUGHHOLE  [LED-TRICOLOR-THROUGHHOLE]
U$35  PCA9306  [TSSOP8]
U$36  PCA9306  [TSSOP8]
U$37  PCA9306  [TSSOP8]
U$38  1.5nH  INDUCTOR0603  [0603]
X1  MINI-USB-UX60-MB-5S8  [UX60-MB-5S8]

## Nets
!ARM_RST: R110.2 SV2.6 U$22.M14(!RESET)
!AVR_RESET: JP4.2 U$22.C13(GPO_08)
!PWR_BATT: IC1.43(PG2(ALE)) R20.1 U$3.17(G1STAT)
!PWR_INT: R19.1 U$3.10(!INT) U$22.A11(GPIO_01)
!PWR_KILL: IC1.34(PG1(RD)) JP5.2
!USB_ATX_INT: U$22.C4(!USB_ATX_INT) U$25.5(!INT)
!USB_OE_TP: U$22.D6(!USB_OE_TP) U$25.9(!OE_TP_INT)
!WL_RST: R64.1 U$22.D12(GPO_03) U$30.8(!RST)
!WL_SPI_CS: U$22.B14(GPO_02/MAT1[0]) U$30.23(!SEL)
+1.2V: C13.1 C85.1 C86.1 C90.1 C93.1 C94.1 C96.1 C97.1 C98.1 C99.1 C100.1 C109.1 C110.1 C111.1 R5.1 R110.1 U$17.3(E) U$22.G7(VDD_CORE$0) U$22.G9(VDD_CORE$1) U$22.G11(VDD_CORE$2) U$22.J7(VDD_CORE$3) U$22.J12(VDD_CORE$4) U$22.L12(VDD_COREFXD$0) U$22.M7(VDD_CORE$5) U$22.M11(VDD_CORE$6) U$22.M13(VDD_COREFXD$1) U$22.P15(VDD_PLLUSB) U$22.R17(VDD_PLLHCLK) U$22.T16(VDD_PLL397) U$22.T18(VDD_OSC)
+1.8V: C10.2 C87.1 C101.1 C102.1 C103.1 C105.1 C106.1 C107.1 C108.1 C112.1 C121.1 C122.1 C123.1 C124.1 C125.1 C126.1 C129.1 C130.1 L3.2 R7.1 U$1.17(BIAS) U$6.A7(VDDQ1) U$6.A9(VDD1) U$6.B3(VDDQ2) U$6.C7(VDDQ3) U$6.D3(VDDQ4) U$6.E7(VDD2) U$6.J9(VDD3) U$17.5($C2) U$22.J6(VDD_EMC$0) U$22.K6(VDD_EMC$1) U$22.K7(VDD_EMC$2) U$22.L6(VDD_EMC$3) U$22.M6(VDD_EMC$4) U$22.M8(VDD_EMC$5) U$22.N7(VDD_EMC$6) U$22.N8(VDD_EMC$7) U$22.N9(VDD_EMC$8) U$22.N10(VDD_EMC$9) U$22.N11(VDD_EMC$10)
+3V3: C18.2 C20.1 C33.1 C34.1 C35.1 C36.1 C37.2 C56.1 C59.1 C62.1 C68.1 C69.1 C72.1 C74.2 C76.2 C78.1 C88.1 C89.1 C91.1 C92.1 C95.1 C114.1 C115.1 C116.1 C117.1 C118.1 C119.1 C120.1 C131.1 C132.1 C143.1 D9.1 D11.1 J1.4(CT_T) J1.5(CT_R) JP1.2 JP2.1 JP6.1 L2.1 Q8.4(E) Q8.5(E) Q9.5(E) Q13.4(E) Q13.5(E) Q16.5(E) R16.2 R19.2 R28.1 R29.2 R30.1 R31.2 R32.2 R33.1 R34.1 R42.2 R43.2 R49.2 R50.2 R55.1 R64.2 R76.2 R77.2 R116.1 R127.14 SV1.3 SV2.4 U2.1(VDD) U2.6(VSS) U2.7(CS) U5.5(VCC) U$7.H8(VDD1) U$7.J6(VDD2) U$16.2(VREF1) U$18.2(VREF1) U$20.4(VDD) U$21.1(IOVDD3.3$1) U$21.18(AVDD3.3) U$21.26(IOVDD3.3$2) U$22.F7(VDD_IOC$0) U$22.F8(VDD_IOB) U$22.F9(VDD_IOD$0) U$22.F13(VDD_IOD$1) U$22.G6(VDD_IOC$1) U$22.H6(VDD_IOC$2) U$22.H13(VDD_IOA$0) U$22.J5(VDD_IOC$3) U$22.J13(VDD_IOA$1) U$22.N12(VDD_AD$0) U$22.N13(VDD_AD$1) U$28.25(VDD) U$28.26(VDD1) U$28.27(VDD2) U$30.15(DEVDD) U$30.28(EVDD) U$31.1(AVDD_PA1) U$31.10(AVDD_PA2) U$35.2(VREF1) U$36.2(VREF1) U$37.2(VREF1)
+5V: C3.2 C17.1 C19.2 C38.1 C47.1 C63.1 C64.1 C65.2 C82.1 C83.1 C133.1 C134.1 D10.1 IC1.21(VCC) IC1.52(VCC1) IC1.62(AREF) IC1.64(AVCC) L1.1 R12.2 R18.2 R20.2 R24.1 R44.2 R45.2 R61.1 R66.1 R67.1 R69.1 R73.1 R74.2 R75.2 R93.2 R94.2 R95.1 R96.1 R99.1 R105.1 R106.2 R108.2 R109.2 R113.2 R115.2 SV1.1 U3.5(VCC) U4.5(VCC) U$2.20(VCC) U$16.6(VREF2) U$18.6(VREF2) U$27.20(VCC) U$29.2 U$33.13(ROSC) U$33.15(VDD) U$35.6(VREF2) U$36.6(VREF2) U$37.6(VREF2)
ACCES_ADC0: IC1.60(PF1(ADC1)) J4.4
ACCES_ADC1: IC1.59(PF2(ADC2)) J4.6
ACCES_DETECT: J3.13 R121.2 U$22.K2(EMC_A[18]/P1[18])
ACCES_PIN0: J4.1 U$22.K3(EMC_A[16]/P1[16])
ACCES_PIN1: J4.2 U$22.K4(EMC_A[17]/P1[17])
ARM_DBGEN: JP6.2 U$22.G14(DBGEN)
AVR_ADC3: IC1.58(PF3(ADC3))
AVR_ADC4: IC1.57(PF4(ADC4/TCK)) J4.8
AVR_ADC5: IC1.56(PF5(ADC5/TMS)) J4.10
AVR_ADC6: IC1.55(PF6(ADC6/TDO)) J4.12
AVR_ADC7: IC1.54(PF7(ADC7/TDI)) J4.14
AVR_CS: IC1.10((SS)PB0)
AVR_MISO: IC1.13((MISO)PB3)
AVR_MOSI: IC1.12((MOSI)PB2)
AVR_SCK: IC1.11((SCK)PB1) U$29.3
AVR_SCL_3.3V: R76.1 U2.14(SCL) U$16.3(SCL1)
AVR_SCL_5V: IC1.25((SCL/INT0)PD0) R74.1 U$16.7(SCL2)
AVR_SDA_3.3V: R77.1 U2.13(SDA) U$16.4(SDA1)
AVR_SDA_5V: IC1.26((SDA/INT1)PD1) R75.1 U$16.8(SDA2)
AVRISP_MISO: IC1.3((TXD/PDO)PE1) R62.2 U$29.1
AVRISP_MOSI: IC1.2((RXD/PDI)PE0) R63.2 U$29.4
BATT_GND: Q18.3(G) R39.1 SV3.1 U$26.6(VSS1) U$26.11(VSS2)
BATT_SCL_3.3V: R43.1 U$18.3(SCL1) U$22.A5(I2C1_SCL)
BATT_SCL_5V: R45.1 U$18.7(SCL2) U$26.3(SCL)
BATT_SDA_3.3V: R42.1 U$18.4(SDA1) U$22.B6(I2C1_SDA)
BATT_SDA_5V: R44.1 U$18.8(SDA2) U$26.4(SDA)
CHARGE_GND: Q19.3(G) R47.1 SV3.3
EDGE_DETECT_0: IC1.7((OC3C/INT5)PE5) J3.14
EDGE_DETECT_1: IC1.8((T3/INT6)PE6) J3.15
EDGE_DETECT_2: IC1.9((IC3/INT7)PE7) J3.16
ETH_RD+: J1.3(RD+) R32.1 U$21.12(RD+)
ETH_RD-: J1.6(RD-) R31.1 U$21.11(RD-)
ETH_TD+: J1.1(TD+) R30.2 U$21.15(TD+)
ETH_TD-: J1.2(TD-) R29.1 U$21.14(TD-)
EXT_BUT_0: IC1.19(PG4(TOSC1)) U3.6(Y)
EXT_BUT_0_RAW: J3.19 R112.1 R113.1
EXT_BUT_1: IC1.18(PG3(TOSC2)) U3.4(Y)
EXT_BUT_1_RAW: J3.20 R57.1 R106.1
GND: C1.2 C3.1 C4.1 C7.1 C10.1 C11.2 C13.2 C14.2 C15.2 C16.2 C17.2 C18.1 C19.1 C20.2 C22.2 C23.2 C24.2 C25.2 C26.2 C27.2 C28.2 C29.2 C30.2 C31.2 C32.2 C33.2 C34.2 C35.2 C36.2 C37.1 C38.2 C39.2 C40.2 C41.2 C42.2 C43.2 C44.2 C45.2 C46.1 C47.2 C48.2 C49.2 C50.2 C51.2 C52.2 C53.2 C54.2 C55.2 C56.2 C59.2 C62.2 C63.2 C64.2 C65.1 C66.2 C67.2 C68.2 C69.2 C70.2 C71.2 C72.2 C73.2 C74.1 C75.2 C76.1 C77.2 C78.2 C81.2 C82.2 C83.2 C84.2 C85.2 C86.2 C87.2 C88.2 C89.2 C90.2 C91.2 C92.2 C93.2 C94.2 C95.2 C96.2 C97.2 C98.2 C99.2 C100.2 C101.2 C102.2 C103.2 C104.2 C105.2 C106.2 C107.2 C108.2 C109.2 C110.2 C111.2 C112.2 C113.2 C114.2 C115.2 C116.2 C117.2 C118.2 C119.2 C120.2 C121.2 C122.2 C123.2 C124.2 C125.2 C126.2 C128.2 C129.2 C130.2 C131.2 C132.2 C133.2 C134.2 C135.2 C136.2 C137.2 C138.2 C139.2 C140.2 C141.2 C143.2 C144.2 C145.2 C146.1 D3.1 D4.1 D7.1 D12.1 IC1.22(GND) IC1.53(GND1) IC1.63(GND) J1.8(GND1) J1.SHIELD1(GND2) J1.SHIELD2(GND3) J2.NEGATIVE(-) J4.3 J4.5 J4.7 J4.9 J4.11 J4.13 J4.15 J4.18 J5.5(GND) JP2.3 JP6.3 LED4.C LED5.C LED6.C LED7.C Q5.10(E) Q5.12(E) Q5.14(E) Q5.16(E) Q6.10(E) Q6.12(E) Q6.14(E) Q6.16(E) Q7.10(E) Q7.12(E) Q7.14(E) Q7.16(E) R2.1 R3.1 R6.2 R8.2 R9.2 R10.1 R11.2 R13.1 R14.1 R15.1 R25.2 R27.2 R35.2 R36.2 R39.2 R40.2 R47.2 R52.2 R65.2 R68.2 R70.2 R71.1 R72.1 R121.1 S1.1 S1.2 S2.1 S2.2 S3.1 S3.2 S4.3 S4.4 SV1.2 SV2.2 SV2.10 SV5.1 SV7.3 U1.4(GND1) U1.17(GND2) U1.20(GND3) U1.24(AGND) U1.26(TEST) U2.2(GND) U2.4(GND1) U2.5(GND2) U2.10(GND3) U3.2(GND) U4.2(GND) U5.2(GND) U$1.39(GND) U$2.3(PGND1_1) U$2.4(PGND1_2) U$2.9(PGND2_1) U$2.10(PGND2_2) U$2.18(GND) U$3.1(VM) U$3.2(PFI) U$3.5(!RST) U$3.6(!PFO) U$3.7(ONT) U$3.9(GND1) U$3.19(M1) U$3.21(GND2) U$4.2(GND) U$4.3(CTL) U$5.1(IBAT) U$5.10(GND) U$5.11(CELL1) U$5.16(PGND) U$6.A1(VSS1) U$6.A3(VSSQ1) U$6.B7(VSSQ2) U$6.C3(VSSQ3) U$6.D7(VSSQ4) U$6.E3(VSS2) U$6.J1(VSS3) U$7.C5(GND1) U$7.K3(GND2) U$7.K8(GND3) U$16.1(GND) U$18.1(GND) U$19.3(S) U$20.6(GND) U$21.13(AGND$1) U$21.17(AGND$2) U$21.29(DGND) U$21.40(IOGND) U$21.41(GND) U$22.F5(VSS_IOC$0) U$22.F6(VSS_IOB) U$22.F10(VSS_IOD$0) U$22.F11(VSS_IOD$1) U$22.F12(VSS_IOD$2) U$22.G5(VSS_IOC$1) U$22.G8(VSS_CORE$0) U$22.G10(VSS_CORE$1) U$22.G12(VSS_CORE$2) U$22.H5(VSS_IOC$2) U$22.H7(VSS_CORE$3) U$22.H12(VSS_IOD$3) U$22.K5(VSS_EMC$0) U$22.K12(VSS_CORE$4) U$22.K13(VSS_IOA) U$22.L5(VSS_EMC$1) U$22.L7(VSS_CORE$5) U$22.L14(VSS_RTCCORE) U$22.M5(VSS_EMC$2) U$22.M9(VSS_CORE$6) U$22.M10(VSS_CORE$7) U$22.M12(VSS_CORE$8) U$22.N5(VSS_EMC$3) U$22.N6(VSS_EMC$4) U$22.P6(VSS_EMC$5) U$22.P7(VSS_EMC$6) U$22.P8(VSS_EMC$7) U$22.P9(VSS_EMC$8) U$22.P10(VSS_EMC$9) U$22.P11(VSS_EMC$10) U$22.P13(VSS_AD) U$22.P14(VSS_OSC) U$22.P18(VSS_RTCOSC) U$22.R16(VSS_PLLUSB) U$22.R18(VSS_PLLHCLK) U$22.T15(VSS_PLL397) U$23.1(GND) U$25.1(ADR_PSW) U$25.17(GND) U$25.23(CGND) U$26.5(SNS) U$26.7(VPROG) U$27.3(PGND1_1) U$27.4(PGND1_2) U$27.9(PGND2_1) U$27.10(PGND2_2) U$27.18(GND) U$28.2(GND) U$28.3(GND1) U$29.6 U$30.3(AVSS1) U$30.6(AVSS2) U$30.7(DVSS1) U$30.12(DVSS2) U$30.16(DVSS3) U$30.18(DVSS4) U$30.21(DVSS5) U$30.27(AVSS3) U$30.30(AVSS4) U$30.31(AVSS5) U$30.32(AVSS6) U$30.33(AVSS7) U$31.8(GND1) U$31.9(GND2) U$31.12(GND3) U$31.14(GND4) U$31.17(GND5) U$32.GND(C) U$33.3(GND1) U$33.9(MS1) U$33.10(MS2) U$33.11(MS3) U$33.18(GND2) U$33.29(GND3) U$34.GND(C) U$35.1(GND) U$36.1(GND) U$37.1(GND) X1.5
GYRO_OUT: C61.1 C145.1 IC1.61(PF0(ADC0)) U$28.6(AOUT)
GYRO_PD_3.3V: U$28.10(PD) U$37.3(SCL1)
GYRO_PD_5V: IC1.31((T1)PD6) U$37.7(SCL2)
GYRO_ST_3.3V: U$28.11(ST) U$37.4(SDA1)
GYRO_ST_5V: IC1.32((T2)PD7) U$37.8(SDA2)
I2C_SCL_3.3V: J4.19 R50.1 U$22.A3(I2C2_SCL) U$35.3(SCL1)
I2C_SCL_5V: J4.17 J4.20 R94.1 U$35.7(SCL2)
I2C_SDA_3.3V: J4.16 R49.1 U$22.E4(I2C2_SDA) U$35.4(SDA1)
I2C_SDA_5V: R93.1 U$35.8(SDA2)
JTAG_NTRST: SV2.8 U$22.H17(JTAG_NTRST)
JTAG_TCK: SV2.1 U$22.H14(JTAG_TCK)
JTAG_TDI: SV2.9 U$22.J16(JTAG_TDI)
JTAG_TDO: SV2.3 U$22.J15(JTAG_TDO)
JTAG_TMS: SV2.5 U$22.G18(JTAG_TMS)
LED0: R128.1 U$22.U9(EMC_D[19]/P2[00])
LED1: R128.2 U$22.T9(EMC_D[20]/P2[01])
LED2: R128.3 U$22.V10(EMC_D[21]/P2[02])
LED3: R128.4 U$22.U10(EMC_D[22]/P2[03])
LED4: R128.5 U$22.T10(EMC_D[23]/P2[04])
LED5: R128.6 U$22.R10(EMC_D[24]/P2[05])
LED6: R129.1 U$22.V11(EMC_D[25]/P2[06])
LED7: R129.2 U$22.U11(EMC_D[26]/P2[07])
LED8: R129.3 U$22.T11(EMC_D[27]/P2[08])
LED9: R129.4 U$22.V12(EMC_D[28]/P2[09])
LED10: R129.5 U$22.V13(EMC_D[29]/P2[10])
LED11: R129.6 U$22.U12(EMC_D[30]/P2[11])
MOTOR0+: SV1.12 U$2.1(AO1_1) U$2.2(AO1_2)
MOTOR0-: SV1.11 U$2.5(AO2_1) U$2.6(AO2_2)
MOTOR0_ENC_A: IC1.51((AD0)PA0) J3.1
MOTOR0_ENC_B: IC1.50((AD1)PA1) J3.2
MOTOR1+: SV1.10 U$2.11(BO1_1) U$2.12(BO1_2)
MOTOR1-: SV1.9 U$2.7(BO2_1) U$2.8(BO2_2)
MOTOR1_ENC_A: IC1.49((AD2)PA2) J3.3
MOTOR1_ENC_B: IC1.48((AD3)PA3) J3.4
MOTOR2+: SV1.8 U$27.7(BO2_1) U$27.8(BO2_2)
MOTOR2-: SV1.7 U$27.11(BO1_1) U$27.12(BO1_2)
MOTOR2_ENC_A: IC1.47((AD4)PA4) J3.5
MOTOR2_ENC_B: IC1.46((AD5)PA5) J3.6
MOTOR3+: SV1.6 U$27.5(AO2_1) U$27.6(AO2_2)
MOTOR3-: SV1.5 U$27.1(AO1_1) U$27.2(AO1_2)
MOTOR3_ENC_A: IC1.45((AD6)PA6) J3.7
MOTOR3_ENC_B: IC1.44((AD7)PA7) J3.8
N$1: C2.1 R1.2 R2.2 U$1.5(OVLO)
N$2: F1.1 Q18.4(S)
N$3: R3.2 U$1.13(RT/SYNC)
N$4: R11.1 R12.1 U$1.9(FB1)
N$5: C5.2 U$1.7(VC1)
N$6: C8.1 D11.2 U$1.32(BOOST3)
N$7: C9.1 D10.2 U$1.1(BOOST1)
N$8: C9.2 D4.2 L1.2 U$1.37(SW1_1) U$1.38(SW1_2)
N$9: C11.1 U$1.21(TRK/SS2)
N$10: C8.2 D12.2 L2.2 U$1.33(SW3_1) U$1.34(SW3_2)
N$11: C4.2 U$1.8(TRK/SS1)
N$12: U$1.24(DRIVE) U$17.6(B)
N$13: C2.2 D9.2 U$1.27(BOOST2)
N$14: C7.2 U$1.18(TRK/SS3)
N$15: C6.2 U$1.19(VC3)
N$16: R14.2 R16.1 U$1.20(FB3)
N$17: U$1.28(SW2_1)
N$18: D7.2 L3.1 U$1.29(SW2_2)
N$19: R7.2 R8.1 U$1.22(FB2)
N$20: C14.1 U$1.26(TRK/SS4)
N$21: C5.1 R13.2
N$22: R5.2 R6.1 U$1.25(FB4)
N$23: C6.1 R15.2
N$24: C12.1 U$1.23(VC2)
N$25: C12.2 R9.1
N$26: U$6.A8(DQ0) U$22.U4(EMC_D[00])
N$27: R51.1 R52.1 U$1.6(UVLO)
N$28: U$6.B9(DQ1) U$22.R7(EMC_D[01])
N$29: U$6.B8(DQ2) U$22.T5(EMC_D[02])
N$30: U$6.C9(DQ3) U$22.U5(EMC_D[03])
N$31: U$6.C8(DQ4) U$22.V3(EMC_D[04])
N$32: U$6.D9(DQ5) U$22.V4(EMC_D[05])
N$33: U$6.D8(DQ6) U$22.T6(EMC_D[06])
N$34: U$6.E9(DQ7) U$22.R8(EMC_D[07])
N$35: U$6.E1(DQ8) U$22.V5(EMC_D[08])
N$36: U$6.D2(DQ9) U$22.U6(EMC_D[09])
N$37: U$6.D1(DQ10) U$22.V6(EMC_D[10])
N$38: U$6.C2(DQ11) U$22.T7(EMC_D[11])
N$39: U$6.C1(DQ12) U$22.U7(EMC_D[12])
N$40: U$6.B2(DQ13) U$22.V7(EMC_D[13])
N$41: U$6.B1(DQ14) U$22.T8(EMC_D[14])
N$42: U$6.A2(DQ15) U$22.U8(EMC_D[15])
N$43: U$6.F2(CLK) U$22.T3(EMC_CLK)
N$44: U$6.F1(UDQ) U$22.P4(EMC_DQM[1])
N$45: U$6.E8(LDQM) U$22.R3(EMC_DQM[0])
N$46: U$6.F6(!WE) U$22.R4(!EMC_WR)
N$47: U$6.F5(!RAS) U$22.T2(!EMC_RAS)
N$48: U$6.F4(!CAS) U$22.R5(!EMC_CAS)
N$49: R85.1 U$34.GRN
N$50: U$6.F3(CKE) U$22.U3(EMC_CKE0)
N$51: U$6.G6(!CS) U$22.U13(!EMC_CS0)
N$52: JP5.1 R18.1 U$3.20(!KILL)
N$53: IC1.20(RESET) JP4.1 R61.2 R111.2
N$54: U$7.H4(I/O0) U$22.H2(FLASH_IO[00])
N$55: U$7.J4(I/O1) U$22.H3(FLASH_IO[01])
N$56: U$7.K4(I/O2) U$22.F1(FLASH_IO[02])
N$57: U$7.K5(I/O3) U$22.E1(FLASH_IO[03])
N$58: U$7.K6(I/O4) U$22.H4(FLASH_IO[04])
N$59: U$7.J7(I/O5) U$22.G2(FLASH_IO[05])
N$60: U$7.K7(I/O6) U$22.G3(FLASH_IO[06])
N$61: U$7.J8(I/O7) U$22.E2(FLASH_IO[07])
N$62: U$7.D5(CL) U$22.F3(FLASH_CLE)
N$63: U$7.C4(AL) U$22.D2(FLASH_ALE)
N$64: U$7.C7(!W) U$22.F2(!FLASH_WR)
N$65: U$7.D4(!R) U$22.C1(!FLASH_RD)
N$66: U$7.C6(!E) U$22.E3(!FLASH_CE)
N$67: U$7.C8(R/!B) U$22.D1(FLASH_RDY)
N$68: U$21.2(TX_CLK) U$22.F15(KEY_COL0/ENET_TX_CLK)
N$69: U$21.3(TX_EN) U$22.D16(KEY_ROW3/ENET_TX_EN)
N$70: R48.2 U$25.16(D+)
N$71: JP2.2 U$22.C15(GPI_01/!SERVICE)
N$72: U$4.5(GATE) U$8.4(G)
N$73: R10.2 R17.1 U$3.18(M2)
N$74: R21.1 U$4.4(STAT) U$12.4(G)
N$75: R17.2 R21.2 U$3.13(V2) U$4.6(SENSE) U$8.5(S) U$9.1(D) U$9.2(D$1) U$9.3(D$2) U$9.6(D$3) U$9.7(D$4) U$9.8(D$5) U$12.5(S)
N$76: IC1.5((OC3A/AIN1)PE3) U$2.23(PWMA)
N$77: U$10.5(S) U$11.5(S)
N$78: U$3.16(G1) U$10.4(G) U$11.4(G)
N$79: U$3.12(G2) U$9.4(G)
N$80: R1.1 R51.2 U$1.4(VINSW)
N$81: C21.1 D1.2 U$5.20(BST)
N$82: IC1.6((OC3B/INT4)PE4) U$2.15(PWMB)
N$83: C21.2 D3.2 L6.2 U$5.19(LX) U$19.1(S) U$19.5($D1) U$19.6(D)
N$84: D8.1 L6.1
N$85: R40.1 R41.2 U$26.9(VIN)
N$86: U$20.3(CMD) U$22.A6(MS_BS/MAT2[1])
N$87: D8.2 R22.2 U$5.15(CS)
N$88: IC1.15((OC1A)PB5) U$27.23(PWMA)
N$89: R24.2 U$18.5(EN)
N$90: R23.2 U$5.4(CCV)
N$91: C24.1 R23.1
N$92: C25.1 U$5.5(CCI)
N$93: R25.1 R26.1 U$5.8(VADJ)
N$94: U$5.18(DHI) U$19.2(G)
N$95: C26.1 R26.2 U$5.6(THM/!SHDN) U$5.7(REF) U$5.9(SETI)
N$96: U$5.17(DLO) U$19.4(G)
N$97: C23.1 D1.1 LED10.A U$5.3(VL) U$5.12(CELL0)
N$98: U$20.7(DATA0) U$22.A8(MS_DIO0/MAT0[0])
N$99: U$20.8(DATA1) U$22.A7(MS_DIO1/MAT0[1])
N$100: U$20.1(DATA2) U$22.B8(MS_DIO2/MAT0[2])
N$101: U$20.2(DATA3) U$22.C8(MS_DIO3/MAT0[3])
N$102: U$20.5(CLK) U$22.B7(MS_SCLK/MAT2[0])
N$103: U$21.4(TXD0) U$22.C17(KEY_ROW4/ENET_TXD0)
N$104: U$21.5(TXD1) U$22.C18(KEY_ROW5/ENET_TXD1)
N$105: U$21.6(TXD2) U$22.E14(KEY_ROW1/ENET_TXD2)
N$106: U$21.7(TXD3) U$22.F14(KEY_ROW2/ENET_TXD3)
N$107: R35.1 U$21.33(CRS/CRS_DV/LED_CFG) U$22.D18(KEY_COL3/ENET_CRS)
N$108: U$21.35(COL/PHYAD0) U$22.E12(GPI_09/KEY_COL7/ENET_COL)
N$109: U$21.36(RXD0/PHYAD1) U$22.G15(KEY_COL4/ENET_RXD0)
N$110: U$21.37(RXD1/PHYAD2) U$22.F16(KEY_COL5/ENET_RXD1)
N$111: U$21.38(RXD2/PHYAD3) U$22.C7(GPI_06/HSTIM_CAP/ENET_RXD2)
N$112: U$21.39(RXD3/PHYAD4) U$22.C14(GPI_02/CAP2[0]/ENET_RXD3)
N$113: U$21.31(RX_CLK) U$22.E16(KEY_COL1/ENET_RX_CLK/ENET_REF_CLK)
N$114: U$21.32(RX_DV/MII_MODE) U$22.B16(GPI_08/KEY_COL6/SPI2_BUSY/ENET_RX_DV)
N$115: U$21.34(RX_ER/MDIX_EN) U$22.D17(KEY_COL2/ENET_RX_ER)
N$116: U$21.24(MDIO) U$22.C11(GPIO_03/KEY_ROW7/ENET_MDIO)
N$117: U$21.25(MDC) U$22.D9(GPIO_02/KEY_ROW6/ENET_MDC)
N$118: U1.30(TXD) U$22.F18(UART5_RX/GPI_20)
N$119: U1.2(RXD) U$22.H15(UART5_TX)
N$120: R27.1 U$7.C3(!WP) U$22.D4(GPO_01)
N$121: C27.1 C144.1 U$3.8(OFFT)
N$122: C28.1 S5.1 S5.2
N$123: C29.1 C30.1 C31.1 C32.1 U$21.16(PFBIN1) U$21.19(PFBOUT) U$21.30(PFBIN2)
N$124: LED23.A R34.2
N$125: R28.2 U$21.23(!RESET)
N$126: LED24.C U$21.22(LED_LINK/AN0)
N$128: Q13.1(B) R119.1
N$129: LED23.C U$21.21(LED_SPEED/AN1)
N$132: LED24.A R33.2
N$133: R36.1 U$21.20(RBIAS)
N$134: C39.1 Q17.3 U$21.27(X2)
N$135: C40.1 Q17.1 U$21.28(X1)
N$136: R63.1 SV5.3 U$36.7(SCL2)
N$137: LED8.C R37.1
N$138: U1.15(USBDM) X1.2
N$139: U1.14(USBDP) X1.3
N$140: LED9.C R38.1
N$141: C43.1 LED8.A LED9.A U1.1(VCCIO) U1.16(3V3OUT)
N$142: L5.2 X1.1
N$143: IC1.16((OC1B)PB6) U$27.15(PWMB)
N$144: R62.1 SV5.2 U$36.8(SDA2)
N$145: C53.1 Q2.2 U$22.P16(RTCX_IN)
N$146: LED22.A R127.1
N$147: C22.1 Q19.4(S) U$5.2(DCIN) U$12.1(D) U$19.7(D) U$19.8($D1)
N$148: C46.2 U$23.2(VOUT) U$26.10(VDD)
N$149: LED21.A R127.2
N$150: LED20.A R127.3
N$151: LED19.A R127.4
N$152: LED18.A R127.5
N$153: LED17.A R127.6
N$154: LED16.A R127.8
N$155: LED15.A R127.9
N$156: LED14.A R127.10
N$157: C48.1 R46.2 U$22.R14(PLL397_LOOP)
N$158: C49.1 R46.1
N$159: C52.1 Q2.1 U$22.P17(RTCX_OUT)
N$160: C51.1 Q1.3 U$22.T17(SYSX_IN)
N$161: C55.1 IC1.24(XTAL1) Q3.3
N$162: C54.1 IC1.23(XTAL2) Q3.1
N$163: C50.1 Q1.1 U$22.R15(SYSX_OUT)
N$164: LED13.A R127.11
N$165: LED12.A R127.12
N$166: IC1.35((A8)PC0) U$2.21(AIN1)
N$167: IC1.36((A9)PC1) U$2.22(AIN2)
N$168: IC1.37((A10)PC2) U$2.17(BIN1)
N$169: IC1.38((A11)PC3) U$2.16(BIN2)
N$170: IC1.42((A15)PC7) U$27.16(BIN2)
N$171: IC1.41((A14)PC6) U$27.17(BIN1)
N$172: IC1.40((A13)PC5) U$27.22(AIN2)
N$173: IC1.39((A12)PC4) U$27.21(AIN1)
N$174: C138.1 R57.2 U3.3(X)
N$175: A1.1 C60.1
N$176: U$30.4(RFP) U$31.4(RF_P)
N$177: U$30.5(RFN) U$31.2(RF_N)
N$178: C66.1 U$30.29(AVDD)
N$179: C67.1 U$30.13(DVDD1) U$30.14(DVDD2)
N$180: C71.1 Q4.3 U$30.25(XTAL2)
N$181: C70.1 Q4.1 U$30.26(XTAL1)
N$182: C57.1 R60.1 U$28.23(VCONT)
N$183: C58.2 R60.2
N$184: C79.2 U$33.4(CP1)
N$185: C57.2 C58.1 U$28.24(FVDD)
N$186: C61.2 U$28.5(CACT)
N$187: C75.1 U$31.16(AVDD_BIAS)
N$188: U$30.1(DIG3) U$31.3(RXTX)
N$190: C73.1 C77.1 U$31.13(AVDD_LNA)
N$191: C79.1 U$33.5(CP2)
N$192: C80.2 U$33.22(VBB1) U$33.28(VBB2)
N$193: C80.1 U$33.6(VCP)
N$194: R68.1 U$33.2(!ENABLE)
N$195: C81.1 U$33.8(VREG)
N$196: R65.1 U$31.15(BIAS)
N$197: SV7.1 U$22.K17(UART2_TX/UART3_DTR)
N$198: R69.2 R70.1 U$33.17(REF)
N$199: R66.2 U$33.14(!SLEEP)
N$200: LED11.A R127.13
N$201: R67.2 U$33.12(!RESET)
N$202: R72.2 U$33.23(SENSE1)
N$203: R71.2 U$33.27(SENSE2)
N$204: LED22.C Q7.3(C)
N$205: LED21.C Q7.5(C)
N$206: R109.1 U$2.19(STBY) U$27.19(STBY)
N$207: LED20.C Q7.7(C)
N$208: LED19.C Q7.1(C)
N$209: LED18.C Q6.7(C)
N$210: R4.1 S5.3 S5.4 U$3.4(!PB)
N$211: LED17.C Q6.3(C)
N$212: LED16.C Q6.5(C)
N$213: LED15.C Q6.1(C)
N$214: LED14.C Q5.7(C)
N$215: LED13.C Q5.5(C)
N$216: LED12.C Q5.3(C)
N$217: LED11.C Q5.1(C)
N$218: C127.1 U$25.21(CAP1)
N$219: C127.2 U$25.22(CAP2)
N$220: SV7.2 U$22.K18(UART2_RX/UART3_DSR/GPI_17)
N$222: C128.1 U$25.7(VTRM)
N$223: TP1.P$1 U$22.C3(GPO_00/TST_CLK1)
N$224: TP2.P$1 U$22.C6(TST_CLK2)
N$225: R84.1 U$34.BLU
N$226: R83.1 U$34.RED
N$227: Q9.6(C) R83.2
N$228: Q8.3(C) R84.2
N$229: Q8.6(C) R85.2
N$230: LED10.C R120.2
N$231: R88.1 U$32.GRN
N$232: R87.1 U$32.BLU
N$233: R86.1 U$32.RED
N$234: Q16.6(C) R86.2
N$235: Q13.3(C) R87.2
N$236: Q13.6(C) R88.2
N$237: R120.1 U$5.13(STATUS)
N$238: Q10.6(B) Q10.7(E) R92.1
N$239: Q20.6(B) Q20.7(E) R90.1
N$240: Q20.3(C) Q20.8(B) R89.2
N$241: Q20.5(E) R90.2 U$2.13(VM2) U$2.14(VM3) U$2.24(VM1)
N$242: Q10.3(C) Q10.8(B) R91.2
N$243: Q10.5(E) R92.2 U$27.13(VM2) U$27.14(VM3) U$27.24(VM1)
N$244: J5.3(D+) R48.1
N$245: R118.2 U$25.15(D-)
N$246: U$22.K16(UART1_TX) U$36.3(SCL1)
N$247: U$22.K15(UART1_RX/CAP1[0]/GPI_15) U$36.4(SDA1)
N$248: R99.2 U$35.5(EN)
N$249: R95.2 U$36.5(EN)
N$250: R96.2 U$37.5(EN)
N$257: U5.4(Y) U$22.E9(GPIO_05/SSEL0)
N$258: C140.1 R56.2 U5.1(X)
N$262: LED4.A R105.2
N$263: LED5.A R54.2
N$264: LED6.A R59.2
N$265: LED7.A R58.2
N$272: R111.1 U$29.5
N$273: J5.2(D-) R118.1
N$274: C139.1 R112.2 U3.1(X)
N$275: C137.1 R114.2 U4.3(X)
N$276: C136.1 R107.2 U4.1(X)
N$277: R107.1 R108.1 S4.1 S4.2
N$278: R114.1 R115.1 S3.3 S3.4
N$279: R55.2 R56.1 S1.3 S1.4
N$280: C141.1 R117.2 U5.3(X)
N$281: R116.2 R117.1 S2.3 S2.4
N$282: U5.6(Y) U$22.B11(GPIO_04/SSEL1)
N$283: U$31.11(ANT) U$38.2
N$284: C60.2 C146.2 U$38.1
N$285: C84.1 C104.1 C113.1 D6.2 U$22.K14(VDD_RTC) U$22.L13(VDD_RTCCORE) U$22.N15(VDD_RTCOSC)
N$286: D6.1 J2.PLUS1(+) J2.PLUS2(+2)
N$287: J5.4(ID) U$25.18(ID)
N$289: C135.1 J5.1(VBUS) U$25.19(VBUS)
N$290: Q7.13(B) R129.9
N$291: Q7.9(B) R129.11
N$292: Q7.11(B) R129.10
N$293: Q7.15(B) R129.12
N$294: Q6.9(B) R129.13
N$295: Q6.13(B) R129.14
N$296: Q6.11(B) R128.9
N$297: Q6.15(B) R128.10
N$298: Q5.9(B) R128.11
N$299: Q5.11(B) R128.12
N$300: Q5.13(B) R128.13
N$301: Q5.15(B) R128.14
N$302: JP1.1 U$25.4(!RESET) U$25.6(SPEED) U$25.8(SUSPEND) U$25.20(VBAT) U$25.24(VIF)
N$303: R73.2 U$16.5(EN)
ORB0_B: Q8.2(B) R125.1 R125.2 U$22.B12(GPO_12/MCOA2)
ORB0_G: Q8.1(B) R124.1 R124.2 U$22.A14(GPO_15/MCOA1)
ORB0_R: Q9.1(B) R126.1 R126.2 U$22.D11(GPO_18/MCOA0)
ORB1_B: Q13.2(B) R122.1 R122.2 U$22.E11(GPO_10/MCOB2)
ORB1_G: R119.2 U$22.B13(GPO_13/MCOB1)
ORB1_R: Q16.1(B) R123.1 R123.2 U$22.D10(GPO_16/MCOB0)
PWR_EN: U$1.14(RUN1) U$1.15(RUN2) U$1.16(RUN3) U$3.11(EN)
PWR_WDOG: IC1.33(PG0(WR)) U$3.3(WDE)
SDRAM_ADDR0: U$6.H7(A0) U$22.L3(EMC_A[00]/P1[00])
SDRAM_ADDR1: U$6.H8(A1) U$22.L4(EMC_A[01]/P1[01])
SDRAM_ADDR2: U$6.J8(A2) U$22.M1(EMC_A[02]/P1[02])
SDRAM_ADDR3: U$6.J7(A3) U$22.M2(EMC_A[03]/P1[03])
SDRAM_ADDR4: U$6.J3(A4) U$22.M3(EMC_A[04]/P1[04])
SDRAM_ADDR5: U$6.J2(A5) U$22.N1(EMC_A[05]/P1[05])
SDRAM_ADDR6: U$6.H3(A6) U$22.N2(EMC_A[06]/P1[06])
SDRAM_ADDR7: U$6.H2(A7) U$22.N3(EMC_A[07]/P1[07])
SDRAM_ADDR8: U$6.H1(A8) U$22.M4(EMC_A[08]/P1[08])
SDRAM_ADDR9: U$6.G3(A9) U$22.P1(EMC_A[09]/P1[09])
SDRAM_ADDR10: U$6.H9(A10) U$22.P2(EMC_A[10]/P1[10])
SDRAM_ADDR11: U$6.G2(A11) U$22.P3(EMC_A[11]/P1[11])
SDRAM_ADDR12: U$6.G1(A12) U$22.N4(EMC_A[12]/P1[12])
SDRAM_ADDR13: U$6.G4(BA0) U$22.R1(EMC_A[13]/P1[13])
SDRAM_ADDR14: U$6.G5(BA1) U$22.R2(EMC_A[14]/P1[14])
SONAR_RX: IC1.28((TXD1/INT3)PD3) J3.18
SONAR_TX: IC1.27((RXD1/INT2)PD2) J3.17
STEP_1A: J3.9 U$33.24(OUT1A)
STEP_1B: J3.10 U$33.21(OUT1B)
STEP_2A: J3.11 U$33.26(OUT2A)
STEP_2B: J3.12 U$33.1(OUT2B)
STEP_DIR: IC1.30((XCK1)PD5) U$33.19(DIR)
STEP_STEP: IC1.29((IC1)PD4) U$33.16(STEP)
USB_DAT_VP: U$22.D5(USB_DAT_VP) U$25.14(DAT_VP)
USB_I2C_SCL: U$22.E5(USB_I2C_SCL) U$25.3(SCL)
USB_I2C_SDA: U$22.E6(USB_I2C_SDA) U$25.2(SDA)
USB_RX_LED: R38.2 U1.21(CBUS1)
USB_SE0_VM: U$22.C5(USB_SE0_VM) U$25.13(SE0_VM)
USB_TX_LED: R37.2 U1.22(CBUS0)
USR_BUT_0: IC1.14((OC0)PB4) U4.4(Y)
USR_BUT_1: IC1.17((OC2/OC1C)PB7) U4.6(Y)
V_LOGIC: C1.1 C15.1 C16.1 R4.2 U$1.2(VIN1_1) U$1.3(VIN1_2) U$1.30(VIN2_1) U$1.31(VIN2_2) U$1.35(VIN3_1) U$1.36(VIN3_2) U$3.14(VS) U$9.5(S) U$10.1(D)
VBATT: C45.1 F1.2 R22.1 R41.1 R59.1 U$3.15(V1) U$5.14(BATT) U$11.1(D) U$23.3(VIN)
VBATT_RAW: Q18.1(D) SV3.2
VCC: Q10.1(C) Q20.1(C) R89.1 R91.1 SV1.4
VCHARGE: Q19.1(D) R58.1 SV3.4
VUSB: C41.1 C42.1 C44.1 L5.1 R54.1 U1.19(VCC) U$4.1(VIN) U$8.1(D)
WL_EN: U$22.A16(GPO_06) U$31.5(PAEN) U$31.6(EN)
WL_HGM: U$22.B3(GPO_05) U$31.7(HGM)
WL_IRQ: U$22.A12(GPIO_00) U$30.24(IRQ)
WL_SLP_TR: U$22.D8(GPO_04) U$30.11(SLP_TR)
WL_SPI_CLK: U$22.C9(SPI1_CLK/SCK0) U$30.19(SCLK)
WL_SPI_MISO: U$22.C10(SPI1_DATIN/MISO0/GPI_25/MCI1) U$30.20(MISO)
WL_SPI_MOSI: U$22.B9(SPI1_DATIO/MOSI0/MCI2) U$30.22(MOSI)
Unconnected: IC1.1(PEN) IC1.4((XCK0/AIN0)PE2) Q1.2(GND) Q1.4(GND1) Q3.2(GND) Q3.4(GND1) Q4.2(GND) Q4.4(GND1) Q5.2(C1) Q5.4(C1) Q5.6(C1) Q5.8(C1) Q6.2(C1) Q6.4(C1) Q6.6(C1) Q6.8(C1) Q7.2(C1) Q7.4(C1) Q7.6(C1) Q7.8(C1) Q9.2(B) Q9.3(C) Q9.4(E) Q10.2(C1) Q10.4(C1) Q16.2(B) Q16.3(C) Q16.4(E) Q18.2(D2) Q18.5(D3) Q18.6(D4) Q19.2(D2) Q19.5(D3) Q19.6(D4) Q20.2(C1) Q20.4(C1) R127.7 R128.7 R128.8 R129.7 R129.8 SV2.7 U1.3(RI#) U1.6(DSR#) U1.7(DCD#) U1.8(CTS#) U1.9(CBUS4) U1.10(CBUS2) U1.11(CBUS3) U1.18(RESET#) U1.27(OSCI) U1.28(OSCO) U1.31(DTR#) U1.32(RTS#) U2.3(NC) U2.8(INT1) U2.9(INT2) U2.11(N/C) U2.12(SDO) U$1.10(PGOOD1) U$1.11(PGOOD2) U$1.12(PGOOD3) U$8.2(D$1) U$8.3(D$2) U$8.6(D$3) U$8.7(D$4) U$8.8(D$5) U$10.2(D$1) U$10.3(D$2) U$10.6(D$3) U$10.7(D$4) U$10.8(D$5) U$11.2(D$1) U$11.3(D$2) U$11.6(D$3) U$11.7(D$4) U$11.8(D$5) U$12.2(D$1) U$12.3(D$2) U$12.6(D$3) U$12.7(D$4) U$12.8(D$5) U$17.2(C) U$22.A4(I2S1TX_CLK/MAT3[0]) U$22.A9(SPI2_DATIO/MOSI1) U$22.A10(SPI2_DATIN/MISO1/GPI_27) U$22.A13(GPO_21/UART4_TX) U$22.A15(GPO_07) U$22.B2(GPO_20) U$22.B4(I2S1TX_WS/CAP3[0]) U$22.B5(P0[0]/I2S1RX_CLK) U$22.B10(SPI2_CLK/SCK1) U$22.B15(GPI_19/UART4_RX) U$22.C2(GPO_19) U$22.C12(GPO_09) U$22.C16(GPI_00/I2S1RX_SDA) U$22.D3(GPO_14) U$22.D7(P0[1]/I2S1RX_WS) U$22.D13(GPI_07/CAP4[0]/!MCABORT) U$22.D14(PWM_OUT1) U$22.D15(PWM_OUT2) U$22.E7(I2S1TX_SDA/MAT3[1]) U$22.E8(GPO_11) U$22.E10(GPO_22/UART7_HRTS) U$22.E13(GPI_04/SPI1_BUSY) U$22.E15(KEY_ROW0/ENET_TX_ER) U$22.E17(UART7_RX/CAP0[0]/GPI_23) U$22.E18(UART7_TX/MAT1[1]) U$22.F4(GPI_03) U$22.F17(UART6_IRRX/GPI_21) U$22.G1(!EMC_DYCS1) U$22.G4(!RESOUT) U$22.G13(UART7_HCTS/CAP0[1]/GPI_22) U$22.G16(UART6_IRTX) U$22.G17(SYSCLKEN) U$22.H1(!EMC_OE) U$22.H16(HIGHCORE) U$22.H18(JTAG_RTCK) U$22.J1(EMC_A[20]/P1[20]) U$22.J2(EMC_A[21]/P1[21]) U$22.J3(EMC_A[22]/P1[22]) U$22.J4(EMC_A[23]/P1[23]) U$22.J14(UART3_RX/GPI_18) U$22.J17(UART3_TX) U$22.J18(UART2_HCTS/UART3_CTS/GPI_16) U$22.K1(EMC_A[19]/P1[19]) U$22.L1(EMC_A[15]/P1[15]) U$22.L2(EMC_CKE1) U$22.L15(P0[4]/I2S0RX_WS) U$22.L16(P0[5]/I2S0TX_SDA) U$22.L17(P0[6]/I2S0TX_CLK) U$22.L18(P0[7]/I2S0TX_WS) U$22.M15(ONSW) U$22.M16(GPO_23/UART2_HRTS/UART3_RTS) U$22.M17(P0[2]/I2S0RX_SDA) U$22.M18(P0[3]/I2S0RX_CLK) U$22.N16(GPI_05/UART3_DCD) U$22.N17(GPI_28/UART3_RI) U$22.N18(GPO_17) U$22.P5(EMC_DQM[3]) U$22.P12(EMC_BLS[3]) U$22.R6(!EMC_DYCS0) U$22.R9(EMC_D[17]/DDR_DQS1) U$22.R11(!EMC_CS1) U$22.R12(EMC_BLS[2]) U$22.R13(TS_XP) U$22.T1(EMC_DQM[2]) U$22.T4(EMC_CLKIN) U$22.T12(!EMC_CS2) U$22.T13(EMC_BLS[1]) U$22.T14(ADIN1/TS_YM) U$22.U14(EMC_BLS[0]) U$22.U15(ADIN0/TS_XM) U$22.U16(TS_YP) U$22.V8(EMC_D[16]/DDR_DQS0) U$22.V9(EMC_D[18]/!DDR_CLK) U$22.V14(EMC_D[31]/P2[12]) U$22.V15(!EMC_CS3) U$22.V16(ADIN2/TS_AUX_IN) U$25.10(VM) U$25.11(VP) U$25.12(RCV) U$26.1(AIN1) U$26.2(AIN0) U$26.8(VOUT) U$30.2(DIG4) U$30.9(DIG1) U$30.10(DIG2) U$30.17(CLKM) X1.4

## Buses
SDRAM_ADDR[0..14]

## Notes on the sheet
- ceramic, x5r or x7r
- output caps can be ceramic, x5r, x7r, or tantalum
- 10uF is a tantalum cap
- 12 mils between each trace, 8mils min
- Tantalum
- Decoupling cap combined with other motor driver

## Power pins joined to a net without a drawn wire
VDD_FUSE: U$22.N14(VDD_FUSE)

## Library data of the parts
A1 = kwoo:ANT-2.4-CHP
C1 C2 C4-C9 C11-C17 C19-C31 C33-C47 C50-C81 C83-C120 C127 C128 C131-C141 C143-C146 = SparkFun:CAP: Capacitor Standard 0603 ceramic capacitor, and 0.1" leaded capacitor.
C3 C10 C18 C32 C48 C49 C82 C121-C126 C129 C130 = rcl:C-EU: CAPACITOR, European symbol
D1 D9-D11 = kwoo:1N41482
D3 D4 D7 D8 D12 = kwoo:MBRS340
D6 = kwoo:BAS69KFILM
F1 = kwoo:MF-SM200
IC1 = atmel:MEGA128: MICROCONTROLLER 128 Kbytes FLASH 4 Kbytes SRAM 4 Kbytes EEPROM DUAL USART 8-channel 10 bit ADC Source: avr.lbr
J1 = kwoo:RJ45_PULSE
J2 = kwoo:KEYSTONE_3000
J3 J4 = kwoo:XF2L
J5 = kwoo:USB_MICRO_AB
JP1 JP4 JP5 = SparkFun:JUMPER-2: Jumper Basic 0.1" spaced jumper. Use with breakaway headers.
JP2 JP6 = SparkFun:JUMPER-3
L1 L2 = kwoo:DR74-XXX-R
L3 = kwoo:NR6045TXXX
L5 = kwoo:MI0805K400R-10
L6 = kwoo:DR125-XXX-R
LED4-LED24 = SparkFun:LED: LEDs Standard schematic elements and footprints for 5mm, 3mm, 1206, and 0603 sized LEDs. 5mm - Spark Fun Electronics SKU : COM-00529 (and others)
Q1 = kwoo:NX5032SA
Q2 = kwoo:ECX-31B
Q3 Q4 = kwoo:NX3225SA
Q5-Q7 = kwoo:MMPQ3904
Q8 Q9 Q13 Q16 = kwoo:DMMT3906W
Q10 Q20 = kwoo:ZDT1053
Q17 = kwoo:ECX-53B
Q18 = kwoo:DMP266LDM
Q19 = kwoo:SI3493BDV
R1-R38 R40-R52 R54-R77 R83-R96 R99 R105-R126 = resistor:R-US_: RESISTOR, American symbol
R39 = SparkFun:RESISTOR: Resistor Basic schematic elements and footprints for 0603, 1206, and PTH 1/10th watt (small) resistors.
R127 = kwoo:RESNET_BUS_13
R128 R129 = kwoo:RESNET_ISO_7
S1-S5 = SparkFun:TAC_SWITCH: Momentary Switch Button commonly used for reset or general input. Spark Fun Electronics SKU : COM-00097
SV1 = kwoo:MA06-2W: PIN HEADER
SV2 = con-lstb:MA05-2: PIN HEADER
SV3 = kwoo:MA02-2W
SV5 SV7 = con-lstb:MA03-1: PIN HEADER
TP1 TP2 = SparkFun:TEST-POINT
U1 = ftdichip-3:FT232RQ: USB UART 4th Generation USB UART (USB <-> Serial) Controller
U2 = SparkFun:ADXL345
U3-U5 = kwoo:NL27WZ14
U$1 = kwoo:LT3507
U$2 U$27 = kwoo:TB6612FNG
U$3 = kwoo:LTC2952
U$4 = kwoo:LTC4412
U$5 = kwoo:MAX745
U$6 = kwoo:MT48H32M16LF
U$7 = kwoo:NAND1GW3B2C
U$8-U$12 = kwoo:SI5401DC
U$16 U$18 U$35-U$37 = kwoo:PCA9306
U$17 = kwoo:NSS30071MR6T1G
U$19 = kwoo:IRF7303
U$20 = kwoo:MICRO-SD
U$21 = kwoo:DP83848J
U$22 = kwoo:LPC3240
U$23 = kwoo:MCP1702
U$25 = kwoo:STOTG04E
U$26 = kwoo:DS2786
U$28 = SparkFun:LISY300AL: Untested part for LIS300AL.
U$29 = SparkFun:AVR_SPI_PRG_6: AVR ISP 6 Pin This is the reduced ISP connector for AVR programming. Common on Arduino. This footprint will take up less PCB space and can be used with a 10-pin to 6-pin adapter such as SKU: BOB-08508
U$30 = kwoo:AT86RF231
U$31 = kwoo:CC2591
U$32 U$34 = SparkFun:LED-TRICOLOR-THROUGHHOLE
U$33 = kwoo:A4983
U$38 = SparkFun:INDUCTOR: Inductors Basic Inductor/Choke - 0603 and 1206. Footprints are not proven and vary greatly between part numbers.
X1 = con-hirose:MINI-USB-: MINI USB Connector Source: http://www.hirose.co.jp/cataloge_hp/e24000019.pdf